# EAGLE schematic I2CRJ45X32 (EAGLE 9.6.2)

## Sheet 1 of 10
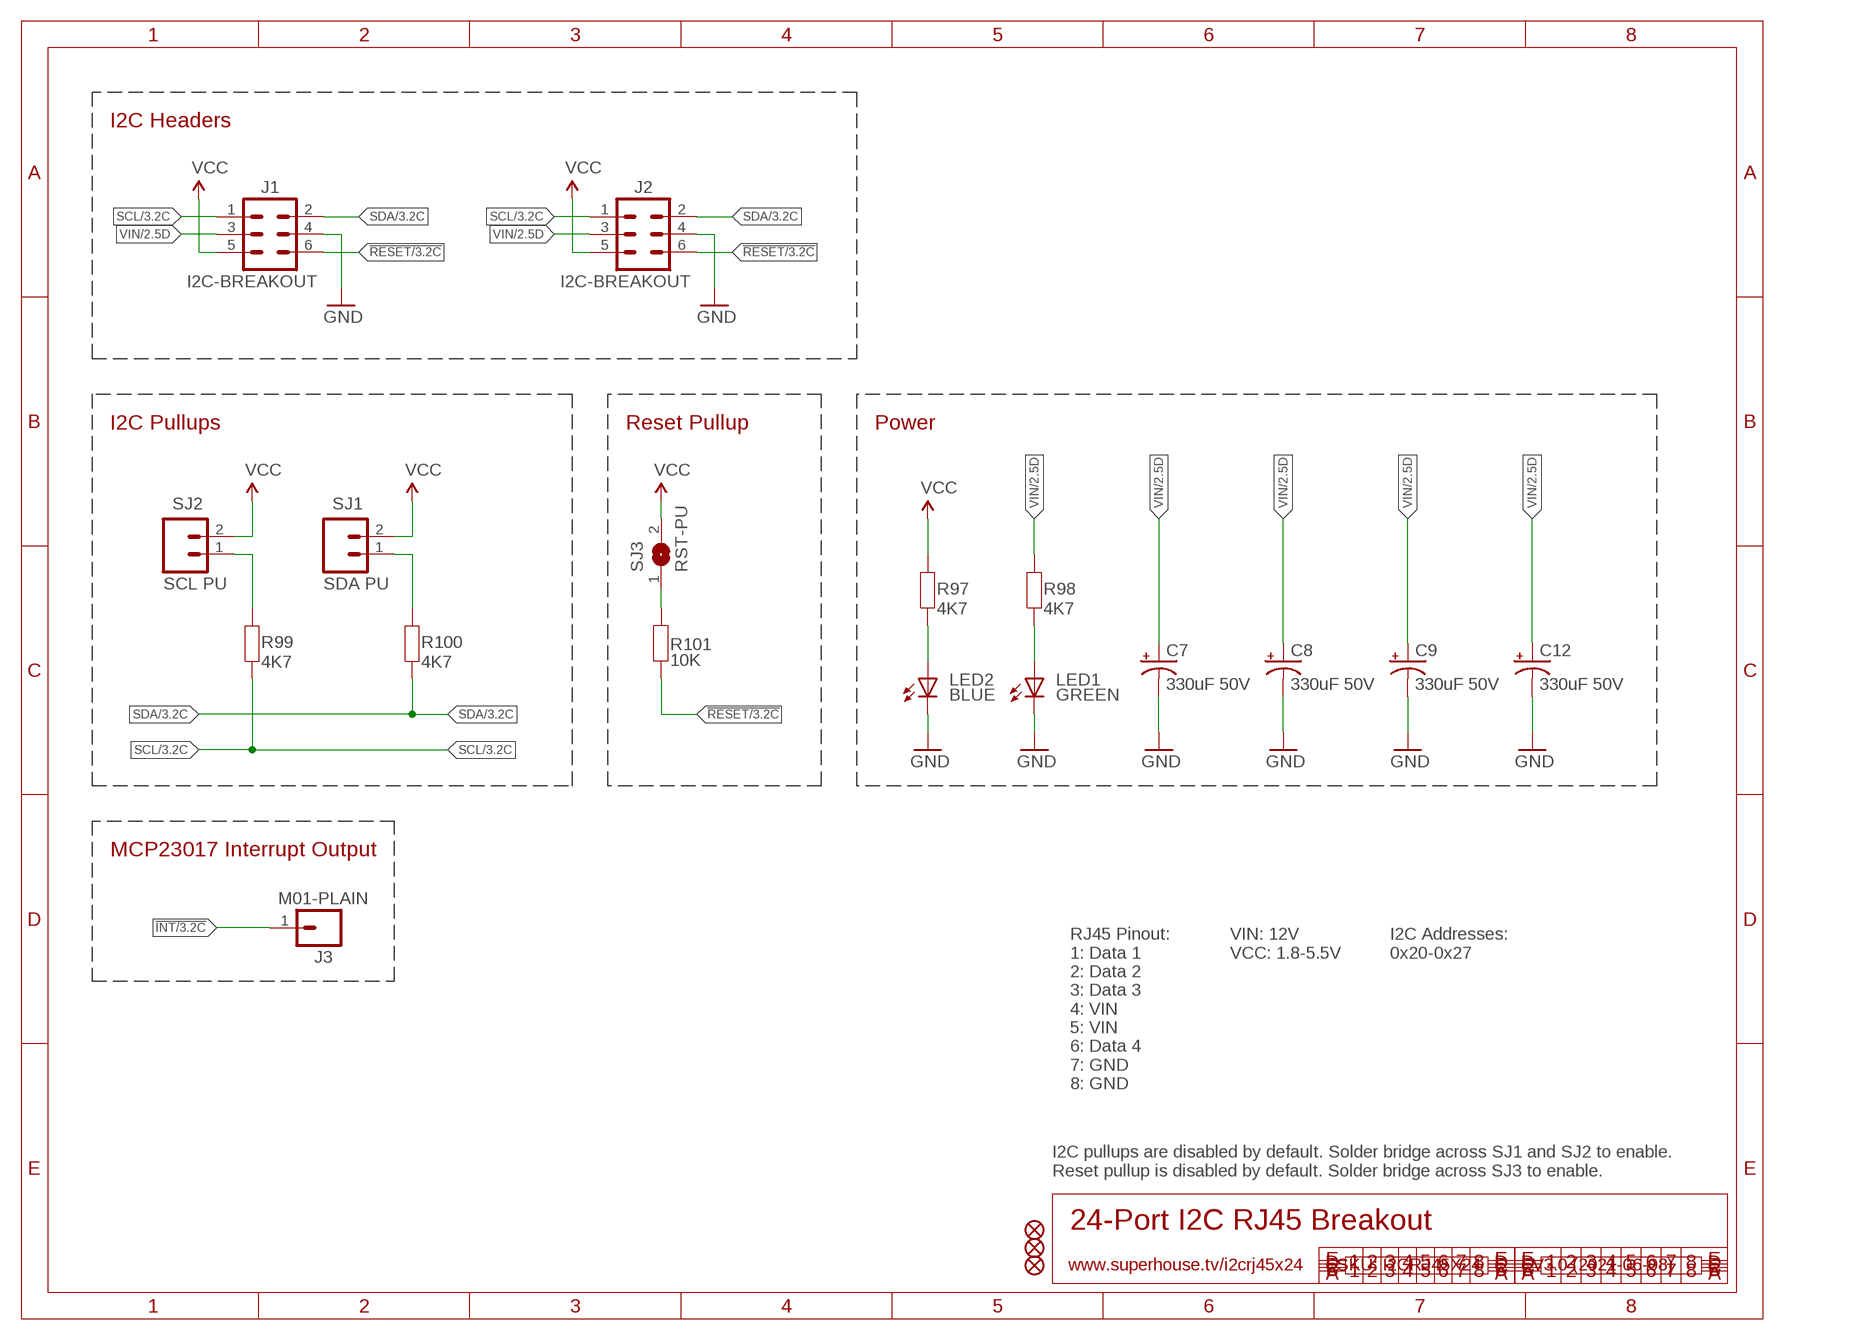
[diagram p0: schematic, sheet 1]

### Parts
C7  330uF 50V  CAP_POLG  [PANASONIC_G]
C8  330uF 50V  CAP_POLG  [PANASONIC_G]
C9  330uF 50V  CAP_POLG  [PANASONIC_G]
C12  330uF 50V  CAP_POLG  [PANASONIC_G]
FID1  FIDUCIAL1X2.5  [FIDUCIAL-1X2.5]
FID2  FIDUCIAL1X2.5  [FIDUCIAL-1X2.5]
FID3  FIDUCIAL1X2.5  [FIDUCIAL-1X2.5]
J1  I2C-BREAKOUT  M02X3-SHROUDED  [2X3-2.54-SHROUDED]
J2  I2C-BREAKOUT  M02X3-SHROUDED  [2X3-2.54-SHROUDED]
J3  M01-PLAIN  [1X01]
LED1  GREEN  LED0603  [LED-0603]
LED2  BLUE  LED0603  [LED-0603]
R97  4K7  RESISTOR0603  [R0603]
R98  4K7  RESISTOR0603  [R0603]
R99  4K7  RESISTOR0603  [R0603]
R100  4K7  RESISTOR0603  [R0603]
R101  10K  RESISTOR0603  [R0603]
SJ1  SDA PU  M02-PIN  [1X02-P]
SJ2  SCL PU  M02-PIN  [1X02-P]
SJ3  RST-PU  SJ-NORMAL  [SJ]

### Nets
!INT: J3.1 ; also sheet 3,4,5,6,7,8,9,10
!RESET: J1.6 J2.6 R101.1 ; also sheet 3,4,5,6,7,8,9,10
GND: C7.- C8.- C9.- C12.- J1.4 J2.4 LED1.C LED2.C ; also sheet 2,3,4,5,6,7,8,9,10
N$1: R99.2 SJ2.1
N$2: R100.2 SJ1.1
N$3: R101.2 SJ3.1
N$7: LED2.A R97.1
N$8: LED1.A R98.1
SCL: J1.1 J2.1 R99.1 ; also sheet 3,4,5,6,7,8,9,10
SDA: J1.2 J2.2 R100.1 ; also sheet 3,4,5,6,7,8,9,10
VCC: J1.5 J2.5 R97.2 SJ1.2 SJ2.2 SJ3.2 ; also sheet 3,4,5,6,7,8,9,10
VIN: C7.+ C8.+ C9.+ C12.+ J1.3 J2.3 R98.2 ; also sheet 2

### Notes on the sheet
- I2C Headers
- I2C Pullups | Reset Pullup | Power
- MCP23017 Interrupt Output
- RJ45 Pinout:
  1: Data 1
  2: Data 2
  3: Data 3
  4: VIN
  5: VIN
  6: Data 4
  7: GND
  8: GND
- VIN: 12V
  VCC: 1.8-5.5V
- I2C Addresses:
  0x20-0x27
- I2C pullups are disabled by default. Solder bridge across SJ1 and SJ2 to enable.
  Reset pullup is disabled by default. Solder bridge across SJ3 to enable.
- 24-Port I2C RJ45 Breakout
- www.superhouse.tv/i2crj45x24 | SKU: I2CRJ45X24 | V3.0 (2021-06-08)

## Sheet 2 of 10
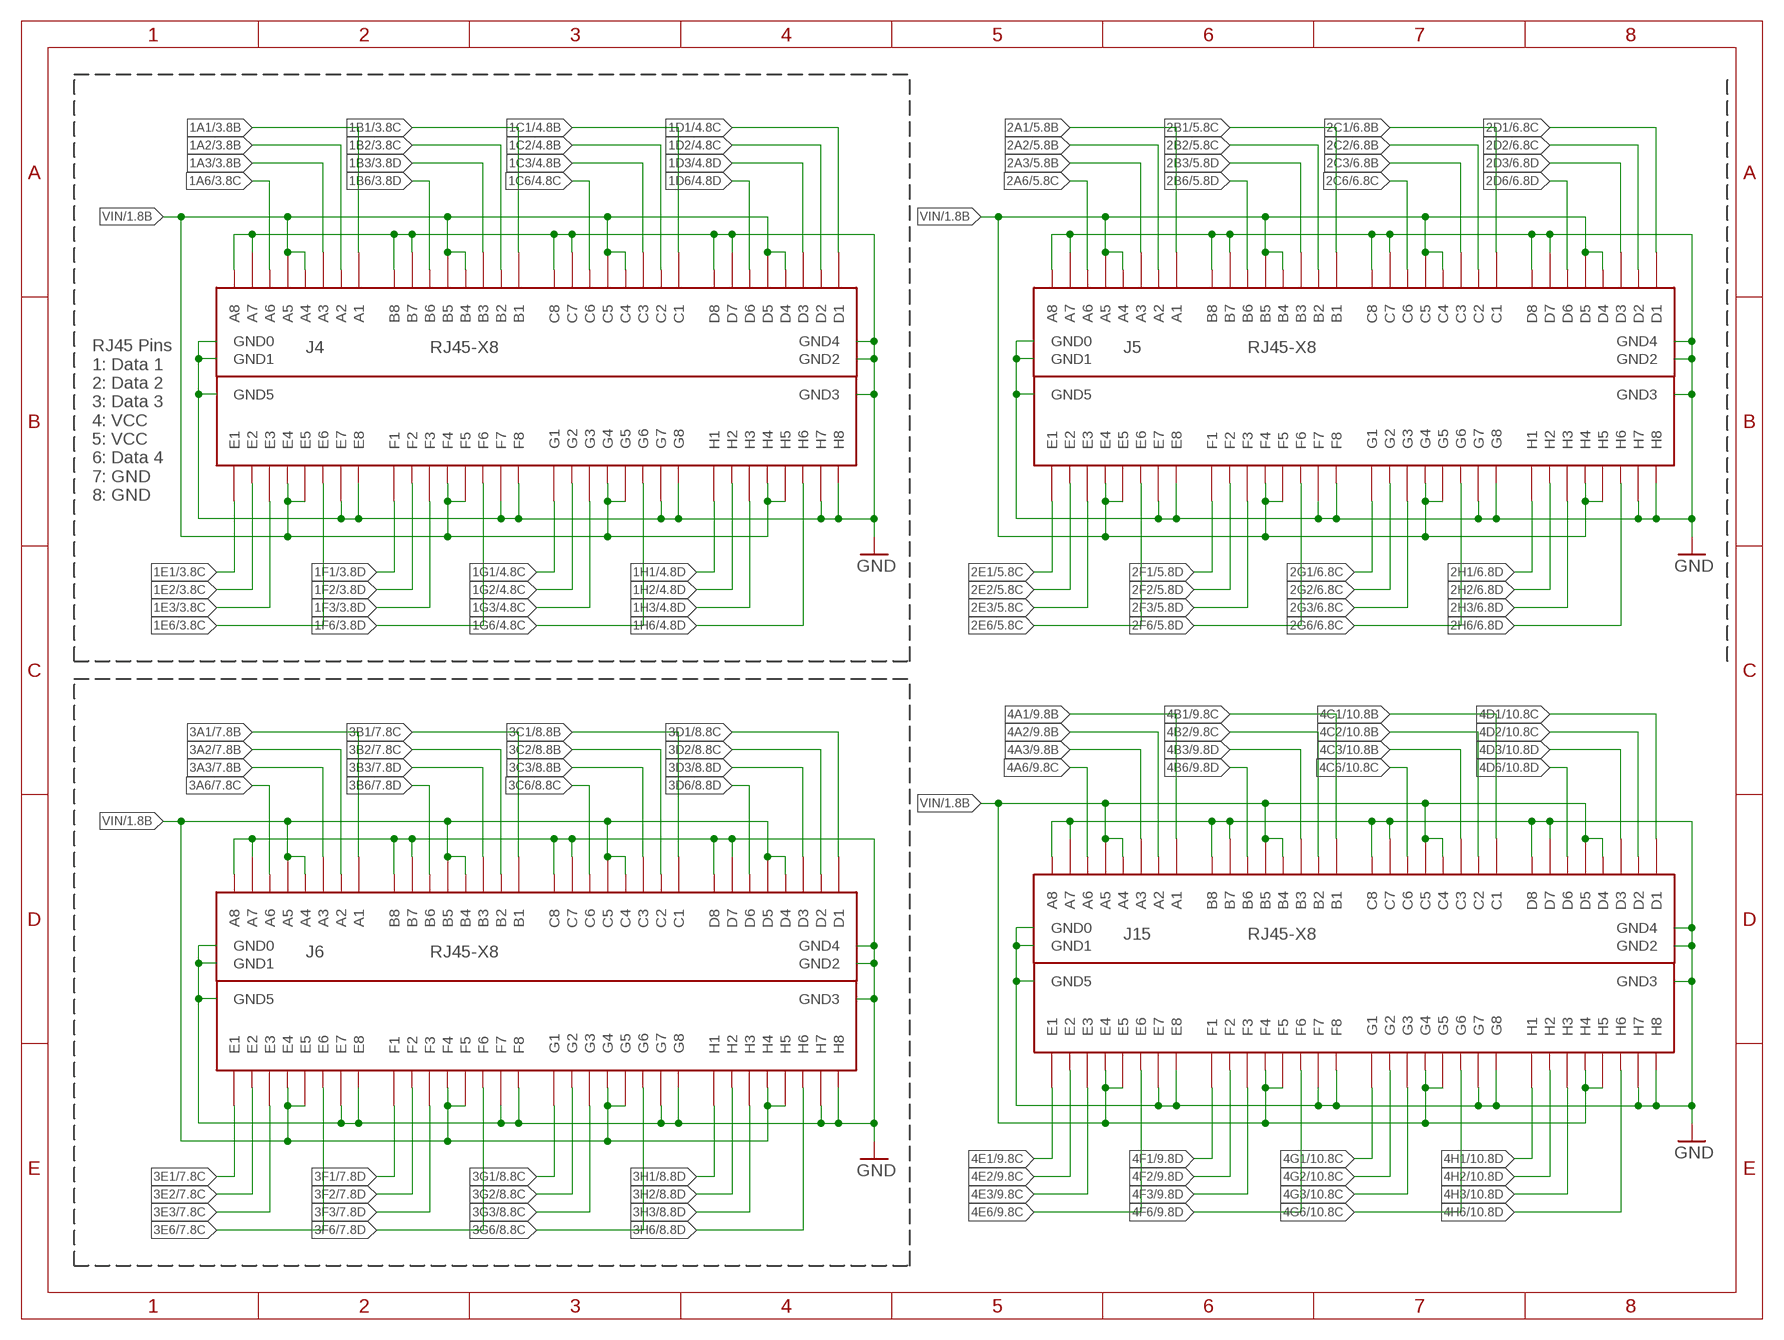
[diagram p1: schematic, sheet 2]

### Parts
J4  RJ45-X8  [RJ45-2X4]
J5  RJ45-X8  [RJ45-2X4]
J6  RJ45-X8  [RJ45-2X4]
J15  RJ45-X8  [RJ45-2X4]

### Nets
1A1: J4.A1 ; also sheet 3
1A2: J4.A2 ; also sheet 3
1A3: J4.A3 ; also sheet 3
1A6: J4.A6 ; also sheet 3
1B1: J4.B1 ; also sheet 3
1B2: J4.B2 ; also sheet 3
1B3: J4.B3 ; also sheet 3
1B6: J4.B6 ; also sheet 3
1C1: J4.C1 ; also sheet 4
1C2: J4.C2 ; also sheet 4
1C3: J4.C3 ; also sheet 4
1C6: J4.C6 ; also sheet 4
1D1: J4.D1 ; also sheet 4
1D2: J4.D2 ; also sheet 4
1D3: J4.D3 ; also sheet 4
1D6: J4.D6 ; also sheet 4
1E1: J4.E1 ; also sheet 3
1E2: J4.E2 ; also sheet 3
1E3: J4.E3 ; also sheet 3
1E6: J4.E6 ; also sheet 3
1F1: J4.F1 ; also sheet 3
1F2: J4.F2 ; also sheet 3
1F3: J4.F3 ; also sheet 3
1F6: J4.F6 ; also sheet 3
1G1: J4.G1 ; also sheet 4
1G2: J4.G2 ; also sheet 4
1G3: J4.G3 ; also sheet 4
1G6: J4.G6 ; also sheet 4
1H1: J4.H1 ; also sheet 4
1H2: J4.H2 ; also sheet 4
1H3: J4.H3 ; also sheet 4
1H6: J4.H6 ; also sheet 4
2A1: J5.A1 ; also sheet 5
2A2: J5.A2 ; also sheet 5
2A3: J5.A3 ; also sheet 5
2A6: J5.A6 ; also sheet 5
2B1: J5.B1 ; also sheet 5
2B2: J5.B2 ; also sheet 5
2B3: J5.B3 ; also sheet 5
2B6: J5.B6 ; also sheet 5
2C1: J5.C1 ; also sheet 6
2C2: J5.C2 ; also sheet 6
2C3: J5.C3 ; also sheet 6
2C6: J5.C6 ; also sheet 6
2D1: J5.D1 ; also sheet 6
2D2: J5.D2 ; also sheet 6
2D3: J5.D3 ; also sheet 6
2D6: J5.D6 ; also sheet 6
2E1: J5.E1 ; also sheet 5
2E2: J5.E2 ; also sheet 5
2E3: J5.E3 ; also sheet 5
2E6: J5.E6 ; also sheet 5
2F1: J5.F1 ; also sheet 5
2F2: J5.F2 ; also sheet 5
2F3: J5.F3 ; also sheet 5
2F6: J5.F6 ; also sheet 5
2G1: J5.G1 ; also sheet 6
2G2: J5.G2 ; also sheet 6
2G3: J5.G3 ; also sheet 6
2G6: J5.G6 ; also sheet 6
2H1: J5.H1 ; also sheet 6
2H2: J5.H2 ; also sheet 6
2H3: J5.H3 ; also sheet 6
2H6: J5.H6 ; also sheet 6
3A1: J6.A1 ; also sheet 7
3A2: J6.A2 ; also sheet 7
3A3: J6.A3 ; also sheet 7
3A6: J6.A6 ; also sheet 7
3B1: J6.B1 ; also sheet 7
3B2: J6.B2 ; also sheet 7
3B3: J6.B3 ; also sheet 7
3B6: J6.B6 ; also sheet 7
3C1: J6.C1 ; also sheet 8
3C2: J6.C2 ; also sheet 8
3C3: J6.C3 ; also sheet 8
3C6: J6.C6 ; also sheet 8
3D1: J6.D1 ; also sheet 8
3D2: J6.D2 ; also sheet 8
3D3: J6.D3 ; also sheet 8
3D6: J6.D6 ; also sheet 8
3E1: J6.E1 ; also sheet 7
3E2: J6.E2 ; also sheet 7
3E3: J6.E3 ; also sheet 7
3E6: J6.E6 ; also sheet 7
3F1: J6.F1 ; also sheet 7
3F2: J6.F2 ; also sheet 7
3F3: J6.F3 ; also sheet 7
3F6: J6.F6 ; also sheet 7
3G1: J6.G1 ; also sheet 8
3G2: J6.G2 ; also sheet 8
3G3: J6.G3 ; also sheet 8
3G6: J6.G6 ; also sheet 8
3H1: J6.H1 ; also sheet 8
3H2: J6.H2 ; also sheet 8
3H3: J6.H3 ; also sheet 8
3H6: J6.H6 ; also sheet 8
4A1: J15.A1 ; also sheet 9
4A2: J15.A2 ; also sheet 9
4A3: J15.A3 ; also sheet 9
4A6: J15.A6 ; also sheet 9
4B1: J15.B1 ; also sheet 9
4B2: J15.B2 ; also sheet 9
4B3: J15.B3 ; also sheet 9
4B6: J15.B6 ; also sheet 9
4C1: J15.C1 ; also sheet 10
4C2: J15.C2 ; also sheet 10
4C3: J15.C3 ; also sheet 10
4C6: J15.C6 ; also sheet 10
4D1: J15.D1 ; also sheet 10
4D2: J15.D2 ; also sheet 10
4D3: J15.D3 ; also sheet 10
4D6: J15.D6 ; also sheet 10
4E1: J15.E1 ; also sheet 9
4E2: J15.E2 ; also sheet 9
4E3: J15.E3 ; also sheet 9
4E6: J15.E6 ; also sheet 9
4F1: J15.F1 ; also sheet 9
4F2: J15.F2 ; also sheet 9
4F3: J15.F3 ; also sheet 9
4F6: J15.F6 ; also sheet 9
4G1: J15.G1 ; also sheet 10
4G2: J15.G2 ; also sheet 10
4G3: J15.G3 ; also sheet 10
4G6: J15.G6 ; also sheet 10
4H1: J15.H1 ; also sheet 10
4H2: J15.H2 ; also sheet 10
4H3: J15.H3 ; also sheet 10
4H6: J15.H6 ; also sheet 10
GND: J4.A7 J4.A8 J4.B7 J4.B8 J4.C7 J4.C8 J4.D7 J4.D8 J4.E7 J4.E8 J4.F7 J4.F8 J4.G7 J4.G8 J4.GND0 J4.GND1 J4.GND2 J4.GND3 J4.GND4 J4.GND5 J4.H7 J4.H8 J5.A7 J5.A8 J5.B7 J5.B8 J5.C7 J5.C8 J5.D7 J5.D8 J5.E7 J5.E8 J5.F7 J5.F8 J5.G7 J5.G8 J5.GND0 J5.GND1 J5.GND2 J5.GND3 J5.GND4 J5.GND5 J5.H7 J5.H8 J6.A7 J6.A8 J6.B7 J6.B8 J6.C7 J6.C8 J6.D7 J6.D8 J6.E7 J6.E8 J6.F7 J6.F8 J6.G7 J6.G8 J6.GND0 J6.GND1 J6.GND2 J6.GND3 J6.GND4 J6.GND5 J6.H7 J6.H8 J15.A7 J15.A8 J15.B7 J15.B8 J15.C7 J15.C8 J15.D7 J15.D8 J15.E7 J15.E8 J15.F7 J15.F8 J15.G7 J15.G8 J15.GND0 J15.GND1 J15.GND2 J15.GND3 J15.GND4 J15.GND5 J15.H7 J15.H8 ; also sheet 1,3,4,5,6,7,8,9,10
VIN: J4.A4 J4.A5 J4.B4 J4.B5 J4.C4 J4.C5 J4.D4 J4.D5 J4.E4 J4.E5 J4.F4 J4.F5 J4.G4 J4.G5 J4.H4 J4.H5 J5.A4 J5.A5 J5.B4 J5.B5 J5.C4 J5.C5 J5.D4 J5.D5 J5.E4 J5.E5 J5.F4 J5.F5 J5.G4 J5.G5 J5.H4 J5.H5 J6.A4 J6.A5 J6.B4 J6.B5 J6.C4 J6.C5 J6.D4 J6.D5 J6.E4 J6.E5 J6.F4 J6.F5 J6.G4 J6.G5 J6.H4 J6.H5 J15.A4 J15.A5 J15.B4 J15.B5 J15.C4 J15.C5 J15.D4 J15.D5 J15.E4 J15.E5 J15.F4 J15.F5 J15.G4 J15.G5 J15.H4 J15.H5 ; also sheet 1

### Notes on the sheet
- RJ45 Pins
  1: Data 1
  2: Data 2
  3: Data 3
  4: VCC
  5: VCC
  6: Data 4
  7: GND
  8: GND

## Sheet 3 of 10
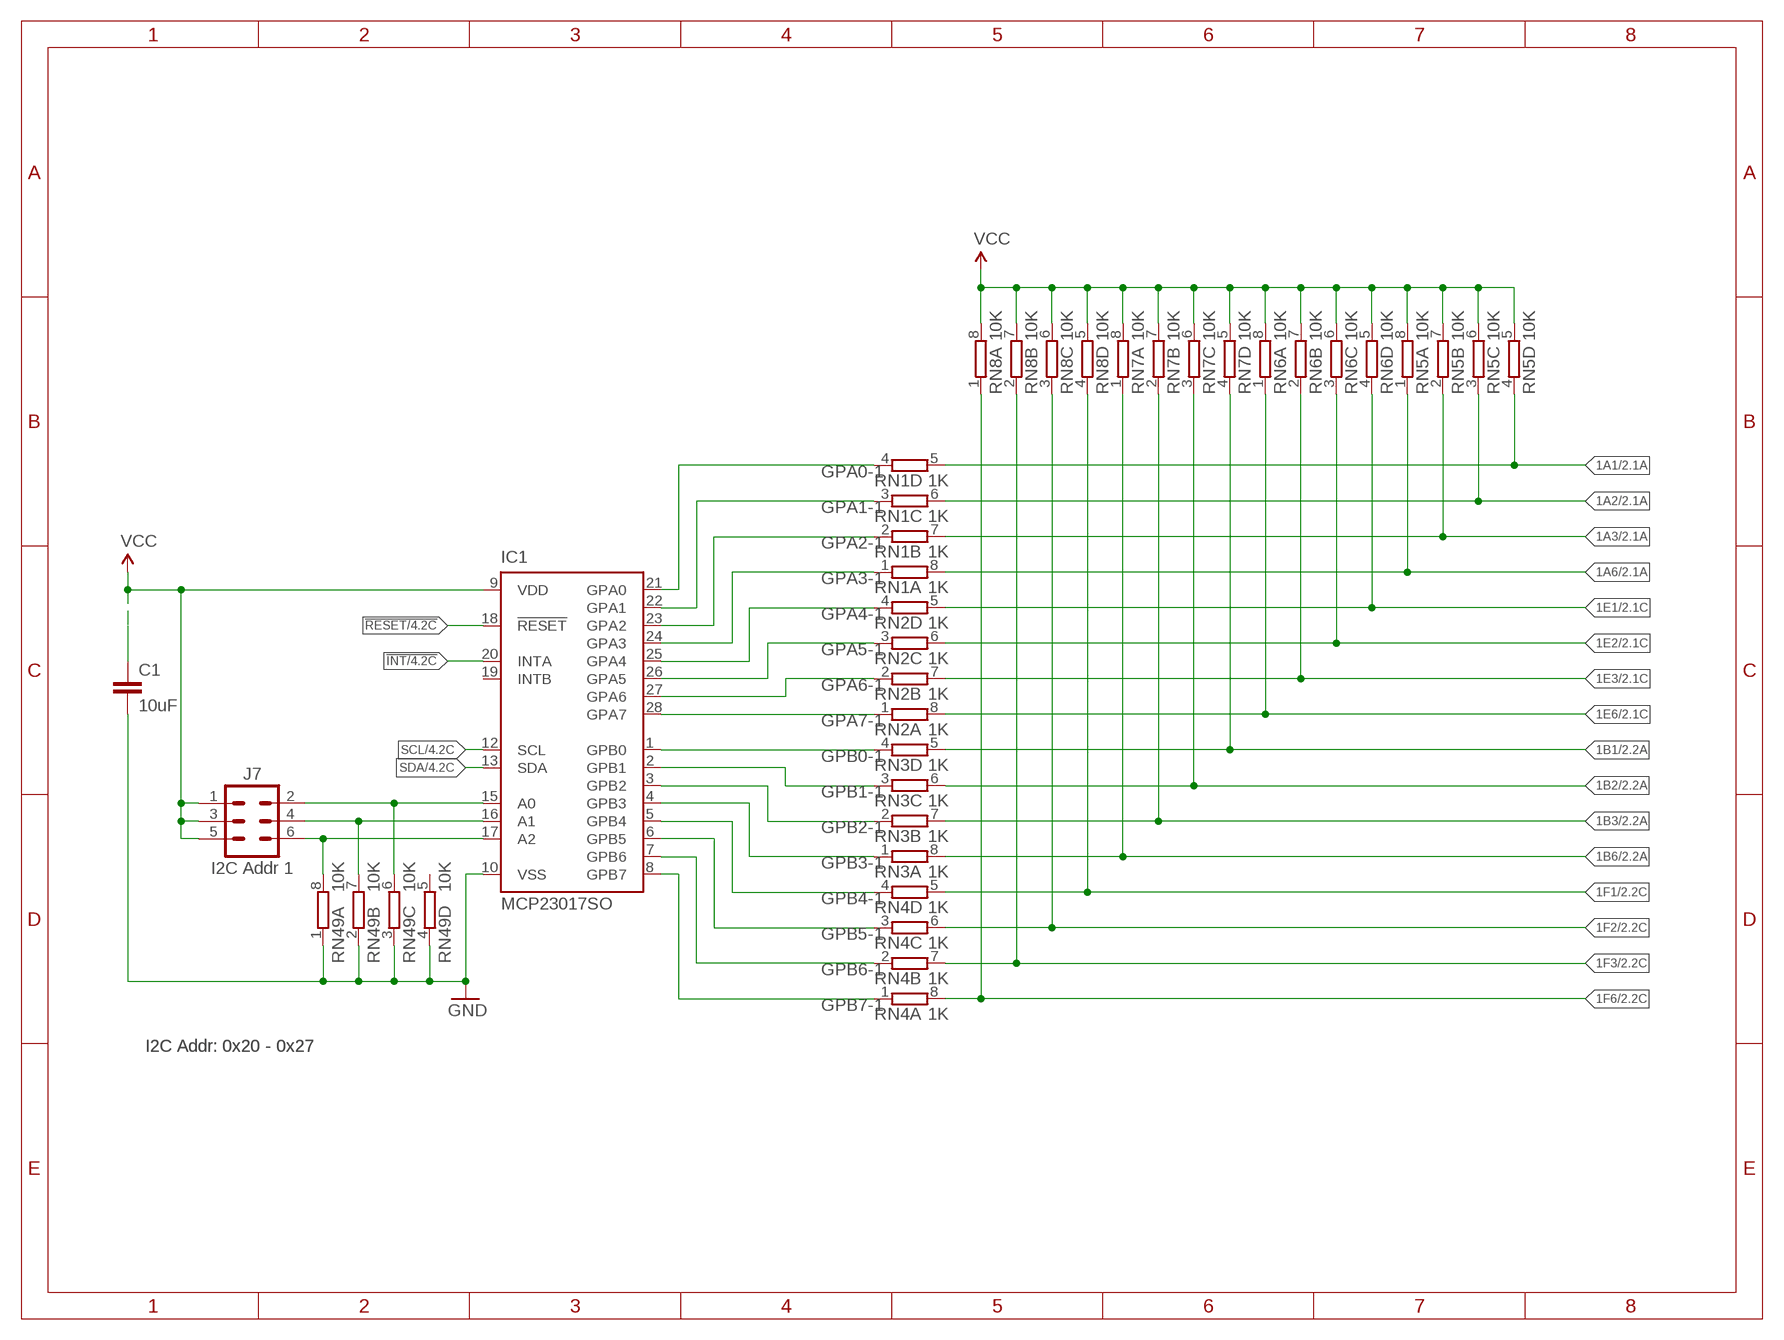
[diagram p2: schematic, sheet 3]

### Parts
C1  10uF  CAP0805  [C0805]
IC1  MCP23017SO  [SO28W]
J7  I2C Addr 1  M02X3-PIN  [2X03-P]
RN1  1K  4R-NCAY16  [CAY16]
RN2  1K  4R-NCAY16  [CAY16]
RN3  1K  4R-NCAY16  [CAY16]
RN4  1K  4R-NCAY16  [CAY16]
RN5  10K  4R-NCAY16  [CAY16]
RN6  10K  4R-NCAY16  [CAY16]
RN7  10K  4R-NCAY16  [CAY16]
RN8  10K  4R-NCAY16  [CAY16]
RN49  10K  4R-NCAY16  [CAY16]

### Nets
1A1: RN1.5 RN5.4 ; also sheet 2
1A2: RN1.6 RN5.3 ; also sheet 2
1A3: RN1.7 RN5.2 ; also sheet 2
1A6: RN1.8 RN5.1 ; also sheet 2
1B1: RN3.5 RN7.4 ; also sheet 2
1B2: RN3.6 RN7.3 ; also sheet 2
1B3: RN3.7 RN7.2 ; also sheet 2
1B6: RN3.8 RN7.1 ; also sheet 2
1E1: RN2.5 RN6.4 ; also sheet 2
1E2: RN2.6 RN6.3 ; also sheet 2
1E3: RN2.7 RN6.2 ; also sheet 2
1E6: RN2.8 RN6.1 ; also sheet 2
1F1: RN4.5 RN8.4 ; also sheet 2
1F2: RN4.6 RN8.3 ; also sheet 2
1F3: RN4.7 RN8.2 ; also sheet 2
1F6: RN4.8 RN8.1 ; also sheet 2
!INT: IC1.20(INTA) ; also sheet 1,4,5,6,7,8,9,10
!RESET: IC1.18(!RESET) ; also sheet 1,4,5,6,7,8,9,10
GND: C1.2 IC1.10(VSS) RN49.1 RN49.2 RN49.3 RN49.4 ; also sheet 1,2,4,5,6,7,8,9,10
GPA0-1: IC1.21(GPA0) RN1.4
GPA1-1: IC1.22(GPA1) RN1.3
GPA2-1: IC1.23(GPA2) RN1.2
GPA3-1: IC1.24(GPA3) RN1.1
GPA4-1: IC1.25(GPA4) RN2.4
GPA5-1: IC1.26(GPA5) RN2.3
GPA6-1: IC1.27(GPA6) RN2.2
GPA7-1: IC1.28(GPA7) RN2.1
GPB0-1: IC1.1(GPB0) RN3.4
GPB1-1: IC1.2(GPB1) RN3.3
GPB2-1: IC1.3(GPB2) RN3.2
GPB3-1: IC1.4(GPB3) RN3.1
GPB4-1: IC1.5(GPB4) RN4.4
GPB5-1: IC1.6(GPB5) RN4.3
GPB6-1: IC1.7(GPB6) RN4.2
GPB7-1: IC1.8(GPB7) RN4.1
N$4: IC1.17(A2) J7.6 RN49.8
N$5: IC1.16(A1) J7.4 RN49.7
N$6: IC1.15(A0) J7.2 RN49.6
SCL: IC1.12(SCL) ; also sheet 1,4,5,6,7,8,9,10
SDA: IC1.13(SDA) ; also sheet 1,4,5,6,7,8,9,10
VCC: C1.1 IC1.9(VDD) J7.1 J7.3 J7.5 RN5.5 RN5.6 RN5.7 RN5.8 RN6.5 RN6.6 RN6.7 RN6.8 RN7.5 RN7.6 RN7.7 RN7.8 RN8.5 RN8.6 RN8.7 RN8.8 ; also sheet 1,4,5,6,7,8,9,10
Unconnected: IC1.19(INTB) RN49.5

### Notes on the sheet
- I2C Addr: 0x20 - 0x27 | I2C Addr: 0x20 - 0x27

## Sheet 4 of 10
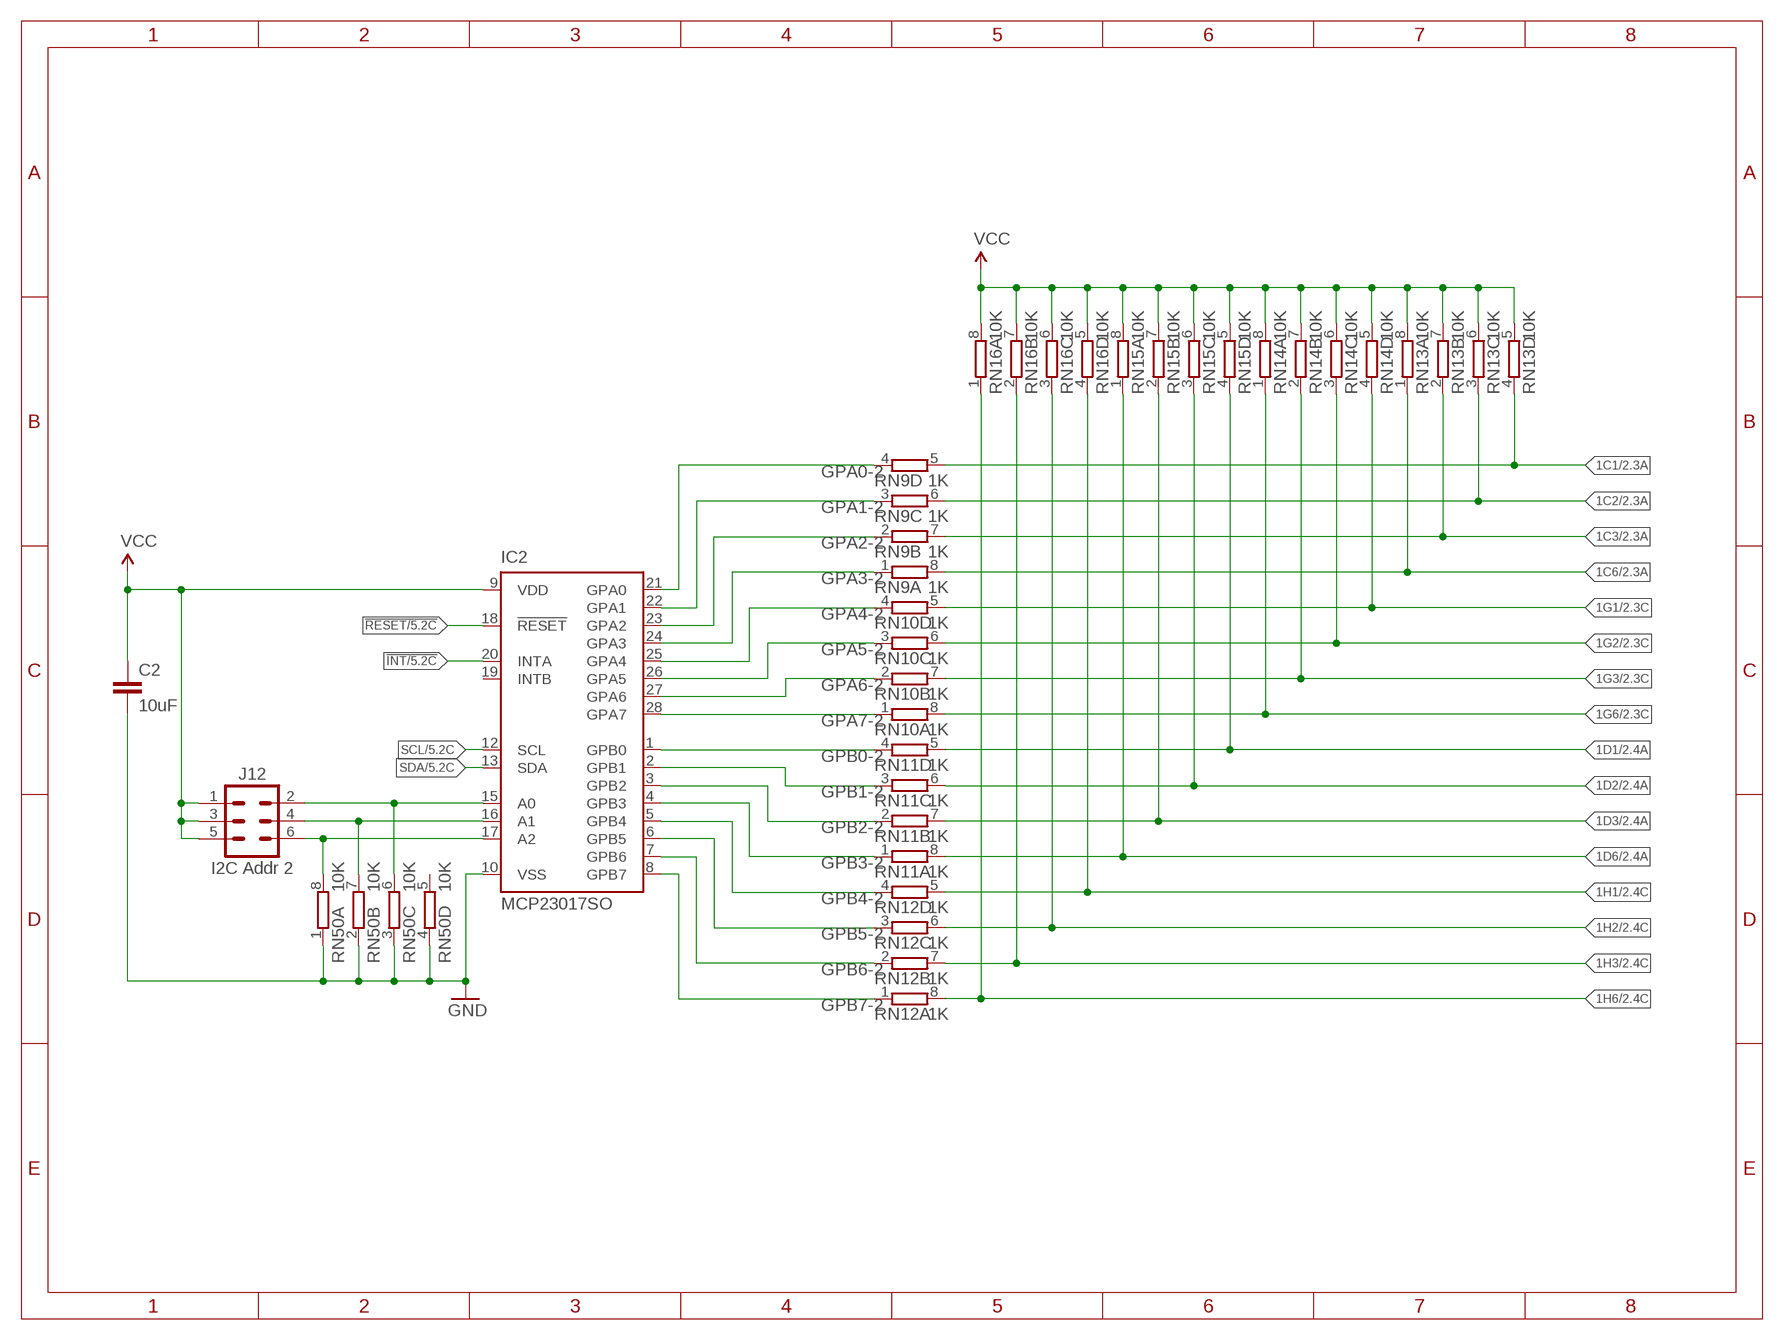
[diagram p3: schematic, sheet 4]

### Parts
C2  10uF  CAP0805  [C0805]
IC2  MCP23017SO  [SO28W]
J12  I2C Addr 2  M02X3-PIN  [2X03-P]
RN9  1K  4R-NCAY16  [CAY16]
RN10  1K  4R-NCAY16  [CAY16]
RN11  1K  4R-NCAY16  [CAY16]
RN12  1K  4R-NCAY16  [CAY16]
RN13  10K  4R-NCAY16  [CAY16]
RN14  10K  4R-NCAY16  [CAY16]
RN15  10K  4R-NCAY16  [CAY16]
RN16  10K  4R-NCAY16  [CAY16]
RN50  10K  4R-NCAY16  [CAY16]

### Nets
1C1: RN9.5 RN13.4 ; also sheet 2
1C2: RN9.6 RN13.3 ; also sheet 2
1C3: RN9.7 RN13.2 ; also sheet 2
1C6: RN9.8 RN13.1 ; also sheet 2
1D1: RN11.5 RN15.4 ; also sheet 2
1D2: RN11.6 RN15.3 ; also sheet 2
1D3: RN11.7 RN15.2 ; also sheet 2
1D6: RN11.8 RN15.1 ; also sheet 2
1G1: RN10.5 RN14.4 ; also sheet 2
1G2: RN10.6 RN14.3 ; also sheet 2
1G3: RN10.7 RN14.2 ; also sheet 2
1G6: RN10.8 RN14.1 ; also sheet 2
1H1: RN12.5 RN16.4 ; also sheet 2
1H2: RN12.6 RN16.3 ; also sheet 2
1H3: RN12.7 RN16.2 ; also sheet 2
1H6: RN12.8 RN16.1 ; also sheet 2
!INT: IC2.20(INTA) ; also sheet 1,3,5,6,7,8,9,10
!RESET: IC2.18(!RESET) ; also sheet 1,3,5,6,7,8,9,10
GND: C2.2 IC2.10(VSS) RN50.1 RN50.2 RN50.3 RN50.4 ; also sheet 1,2,3,5,6,7,8,9,10
GPA0-2: IC2.21(GPA0) RN9.4
GPA1-2: IC2.22(GPA1) RN9.3
GPA2-2: IC2.23(GPA2) RN9.2
GPA3-2: IC2.24(GPA3) RN9.1
GPA4-2: IC2.25(GPA4) RN10.4
GPA5-2: IC2.26(GPA5) RN10.3
GPA6-2: IC2.27(GPA6) RN10.2
GPA7-2: IC2.28(GPA7) RN10.1
GPB0-2: IC2.1(GPB0) RN11.4
GPB1-2: IC2.2(GPB1) RN11.3
GPB2-2: IC2.3(GPB2) RN11.2
GPB3-2: IC2.4(GPB3) RN11.1
GPB4-2: IC2.5(GPB4) RN12.4
GPB5-2: IC2.6(GPB5) RN12.3
GPB6-2: IC2.7(GPB6) RN12.2
GPB7-2: IC2.8(GPB7) RN12.1
N$9: IC2.15(A0) J12.2 RN50.6
N$10: IC2.16(A1) J12.4 RN50.7
N$11: IC2.17(A2) J12.6 RN50.8
SCL: IC2.12(SCL) ; also sheet 1,3,5,6,7,8,9,10
SDA: IC2.13(SDA) ; also sheet 1,3,5,6,7,8,9,10
VCC: C2.1 IC2.9(VDD) J12.1 J12.3 J12.5 RN13.5 RN13.6 RN13.7 RN13.8 RN14.5 RN14.6 RN14.7 RN14.8 RN15.5 RN15.6 RN15.7 RN15.8 RN16.5 RN16.6 RN16.7 RN16.8 ; also sheet 1,3,5,6,7,8,9,10
Unconnected: IC2.19(INTB) RN50.5

## Sheet 5 of 10
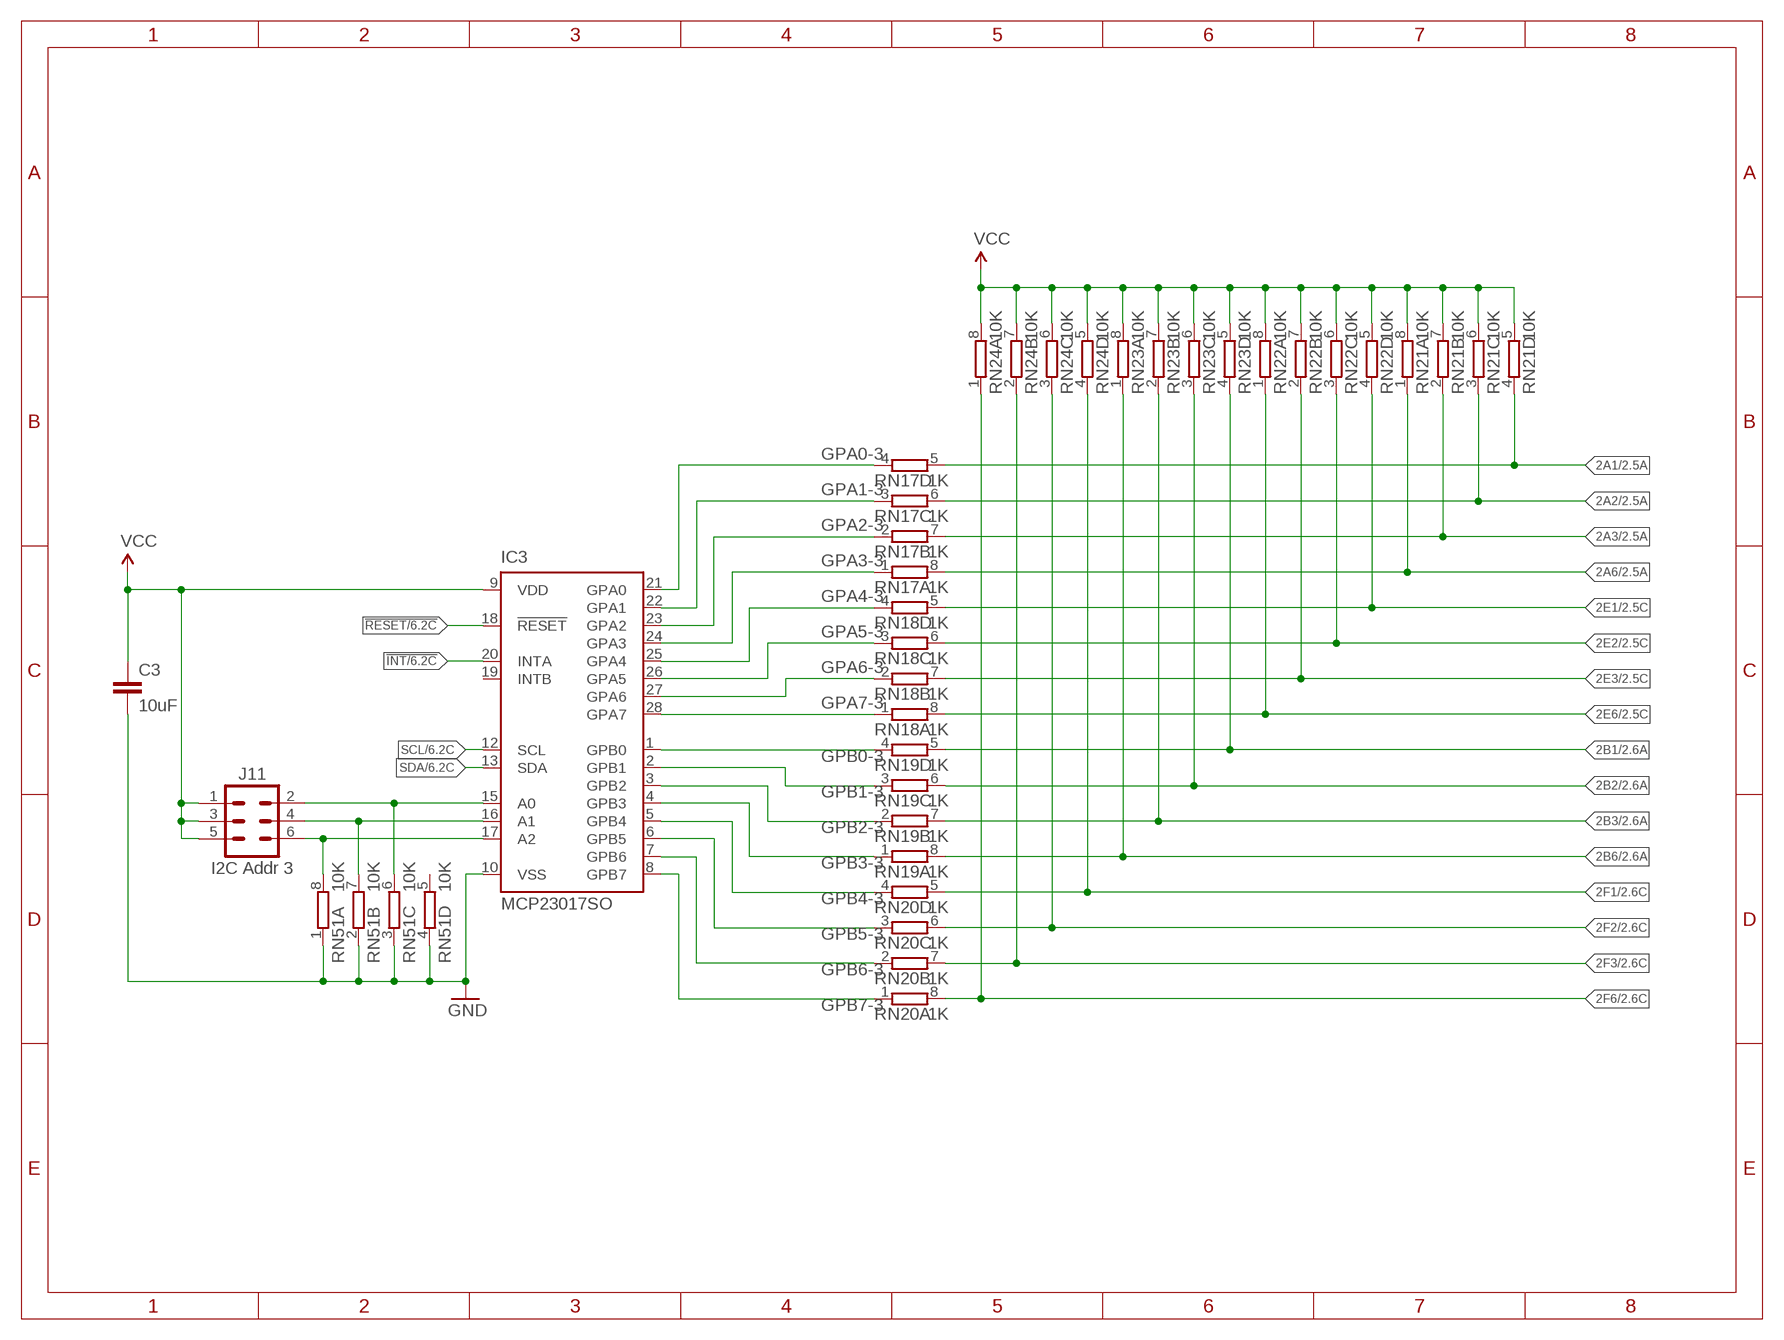
[diagram p4: schematic, sheet 5]

### Parts
C3  10uF  CAP0805  [C0805]
IC3  MCP23017SO  [SO28W]
J11  I2C Addr 3  M02X3-PIN  [2X03-P]
RN17  1K  4R-NCAY16  [CAY16]
RN18  1K  4R-NCAY16  [CAY16]
RN19  1K  4R-NCAY16  [CAY16]
RN20  1K  4R-NCAY16  [CAY16]
RN21  10K  4R-NCAY16  [CAY16]
RN22  10K  4R-NCAY16  [CAY16]
RN23  10K  4R-NCAY16  [CAY16]
RN24  10K  4R-NCAY16  [CAY16]
RN51  10K  4R-NCAY16  [CAY16]

### Nets
2A1: RN17.5 RN21.4 ; also sheet 2
2A2: RN17.6 RN21.3 ; also sheet 2
2A3: RN17.7 RN21.2 ; also sheet 2
2A6: RN17.8 RN21.1 ; also sheet 2
2B1: RN19.5 RN23.4 ; also sheet 2
2B2: RN19.6 RN23.3 ; also sheet 2
2B3: RN19.7 RN23.2 ; also sheet 2
2B6: RN19.8 RN23.1 ; also sheet 2
2E1: RN18.5 RN22.4 ; also sheet 2
2E2: RN18.6 RN22.3 ; also sheet 2
2E3: RN18.7 RN22.2 ; also sheet 2
2E6: RN18.8 RN22.1 ; also sheet 2
2F1: RN20.5 RN24.4 ; also sheet 2
2F2: RN20.6 RN24.3 ; also sheet 2
2F3: RN20.7 RN24.2 ; also sheet 2
2F6: RN20.8 RN24.1 ; also sheet 2
!INT: IC3.20(INTA) ; also sheet 1,3,4,6,7,8,9,10
!RESET: IC3.18(!RESET) ; also sheet 1,3,4,6,7,8,9,10
GND: C3.2 IC3.10(VSS) RN51.1 RN51.2 RN51.3 RN51.4 ; also sheet 1,2,3,4,6,7,8,9,10
GPA0-3: IC3.21(GPA0) RN17.4
GPA1-3: IC3.22(GPA1) RN17.3
GPA2-3: IC3.23(GPA2) RN17.2
GPA3-3: IC3.24(GPA3) RN17.1
GPA4-3: IC3.25(GPA4) RN18.4
GPA5-3: IC3.26(GPA5) RN18.3
GPA6-3: IC3.27(GPA6) RN18.2
GPA7-3: IC3.28(GPA7) RN18.1
GPB0-3: IC3.1(GPB0) RN19.4
GPB1-3: IC3.2(GPB1) RN19.3
GPB2-3: IC3.3(GPB2) RN19.2
GPB3-3: IC3.4(GPB3) RN19.1
GPB4-3: IC3.5(GPB4) RN20.4
GPB5-3: IC3.6(GPB5) RN20.3
GPB6-3: IC3.7(GPB6) RN20.2
GPB7-3: IC3.8(GPB7) RN20.1
N$12: IC3.17(A2) J11.6 RN51.8
N$13: IC3.15(A0) J11.2 RN51.6
N$14: IC3.16(A1) J11.4 RN51.7
SCL: IC3.12(SCL) ; also sheet 1,3,4,6,7,8,9,10
SDA: IC3.13(SDA) ; also sheet 1,3,4,6,7,8,9,10
VCC: C3.1 IC3.9(VDD) J11.1 J11.3 J11.5 RN21.5 RN21.6 RN21.7 RN21.8 RN22.5 RN22.6 RN22.7 RN22.8 RN23.5 RN23.6 RN23.7 RN23.8 RN24.5 RN24.6 RN24.7 RN24.8 ; also sheet 1,3,4,6,7,8,9,10
Unconnected: IC3.19(INTB) RN51.5

## Sheet 6 of 10
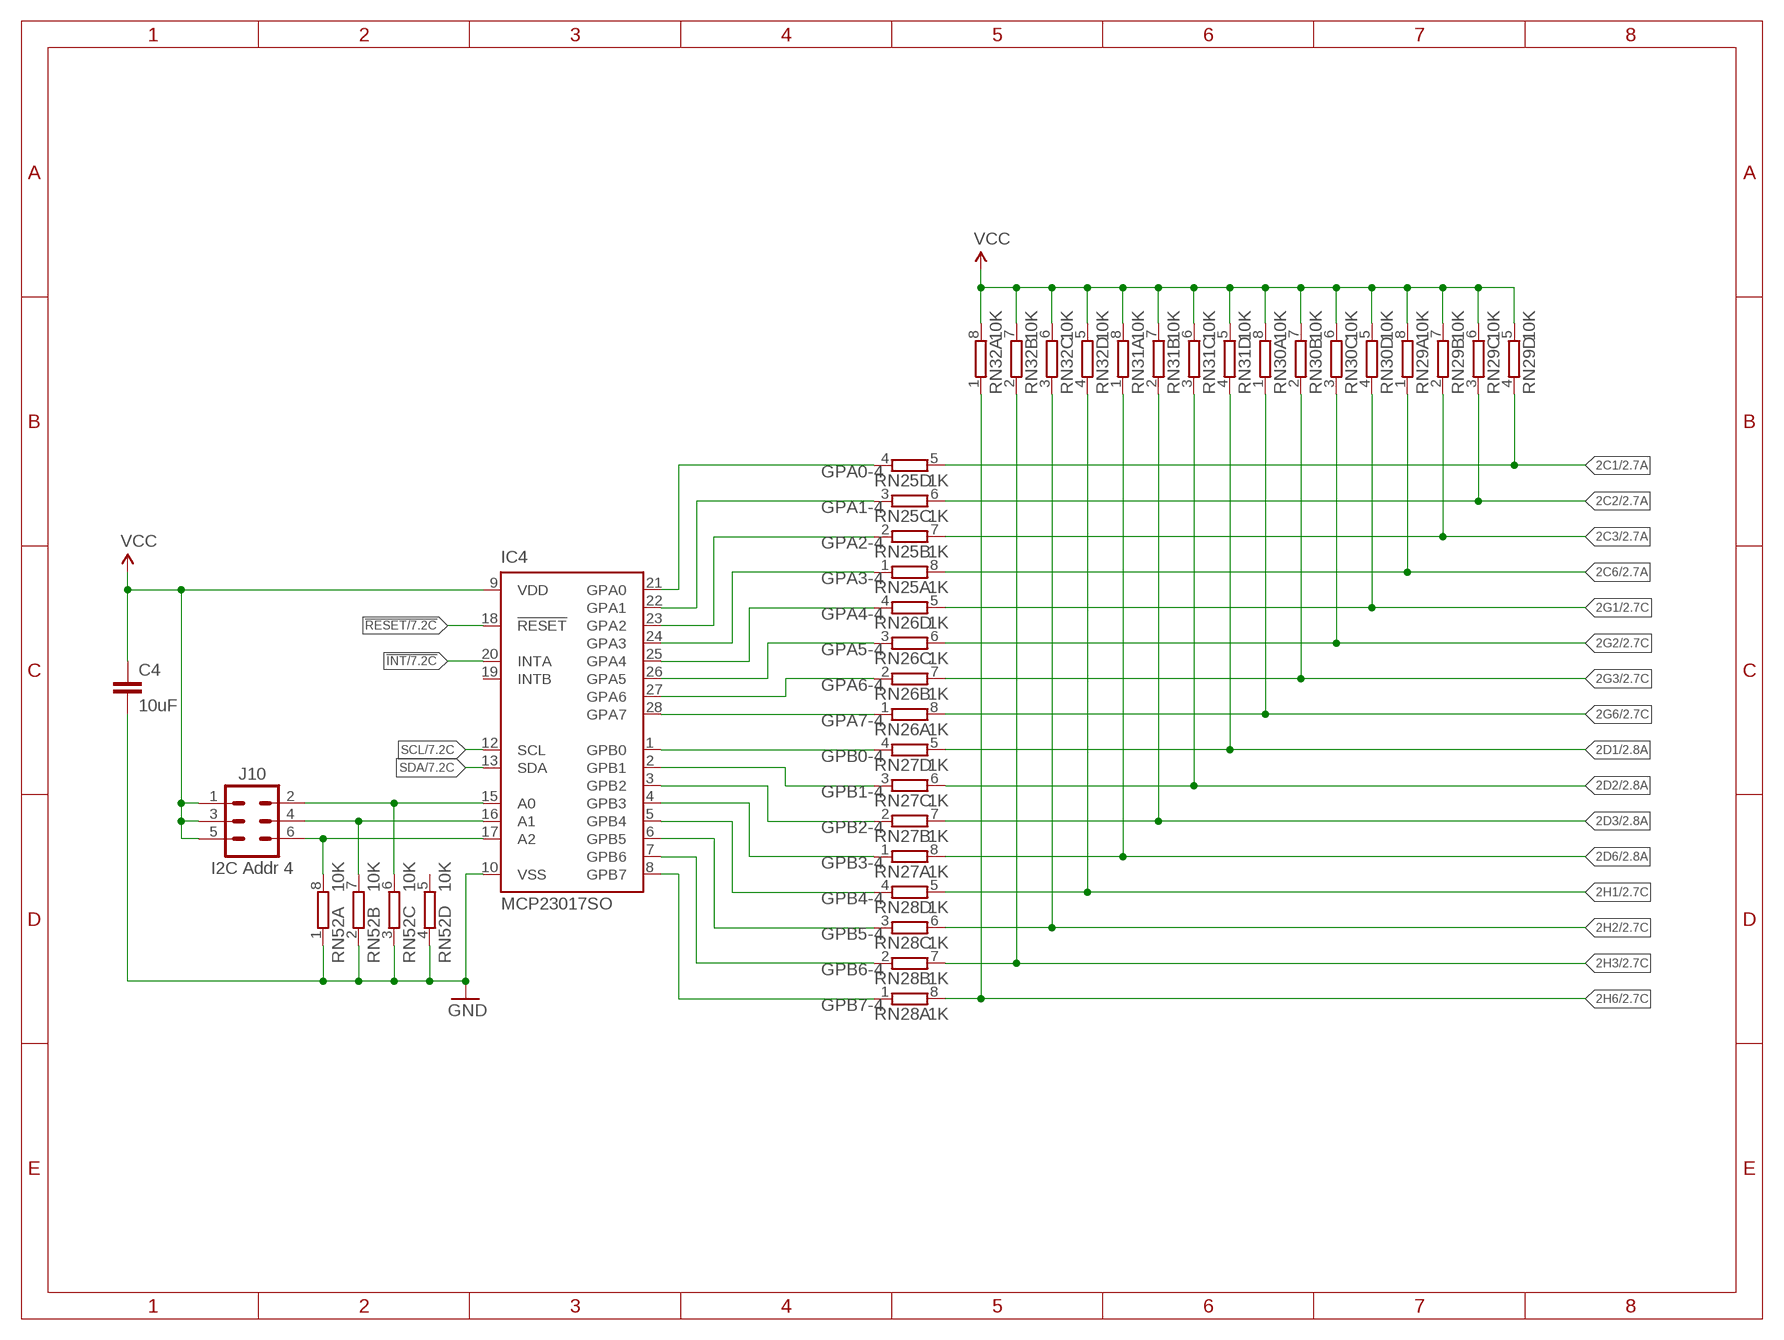
[diagram p5: schematic, sheet 6]

### Parts
C4  10uF  CAP0805  [C0805]
IC4  MCP23017SO  [SO28W]
J10  I2C Addr 4  M02X3-PIN  [2X03-P]
RN25  1K  4R-NCAY16  [CAY16]
RN26  1K  4R-NCAY16  [CAY16]
RN27  1K  4R-NCAY16  [CAY16]
RN28  1K  4R-NCAY16  [CAY16]
RN29  10K  4R-NCAY16  [CAY16]
RN30  10K  4R-NCAY16  [CAY16]
RN31  10K  4R-NCAY16  [CAY16]
RN32  10K  4R-NCAY16  [CAY16]
RN52  10K  4R-NCAY16  [CAY16]

### Nets
2C1: RN25.5 RN29.4 ; also sheet 2
2C2: RN25.6 RN29.3 ; also sheet 2
2C3: RN25.7 RN29.2 ; also sheet 2
2C6: RN25.8 RN29.1 ; also sheet 2
2D1: RN27.5 RN31.4 ; also sheet 2
2D2: RN27.6 RN31.3 ; also sheet 2
2D3: RN27.7 RN31.2 ; also sheet 2
2D6: RN27.8 RN31.1 ; also sheet 2
2G1: RN26.5 RN30.4 ; also sheet 2
2G2: RN26.6 RN30.3 ; also sheet 2
2G3: RN26.7 RN30.2 ; also sheet 2
2G6: RN26.8 RN30.1 ; also sheet 2
2H1: RN28.5 RN32.4 ; also sheet 2
2H2: RN28.6 RN32.3 ; also sheet 2
2H3: RN28.7 RN32.2 ; also sheet 2
2H6: RN28.8 RN32.1 ; also sheet 2
!INT: IC4.20(INTA) ; also sheet 1,3,4,5,7,8,9,10
!RESET: IC4.18(!RESET) ; also sheet 1,3,4,5,7,8,9,10
GND: C4.2 IC4.10(VSS) RN52.1 RN52.2 RN52.3 RN52.4 ; also sheet 1,2,3,4,5,7,8,9,10
GPA0-4: IC4.21(GPA0) RN25.4
GPA1-4: IC4.22(GPA1) RN25.3
GPA2-4: IC4.23(GPA2) RN25.2
GPA3-4: IC4.24(GPA3) RN25.1
GPA4-4: IC4.25(GPA4) RN26.4
GPA5-4: IC4.26(GPA5) RN26.3
GPA6-4: IC4.27(GPA6) RN26.2
GPA7-4: IC4.28(GPA7) RN26.1
GPB0-4: IC4.1(GPB0) RN27.4
GPB1-4: IC4.2(GPB1) RN27.3
GPB2-4: IC4.3(GPB2) RN27.2
GPB3-4: IC4.4(GPB3) RN27.1
GPB4-4: IC4.5(GPB4) RN28.4
GPB5-4: IC4.6(GPB5) RN28.3
GPB6-4: IC4.7(GPB6) RN28.2
GPB7-4: IC4.8(GPB7) RN28.1
N$15: IC4.17(A2) J10.6 RN52.8
N$16: IC4.15(A0) J10.2 RN52.6
N$17: IC4.16(A1) J10.4 RN52.7
SCL: IC4.12(SCL) ; also sheet 1,3,4,5,7,8,9,10
SDA: IC4.13(SDA) ; also sheet 1,3,4,5,7,8,9,10
VCC: C4.1 IC4.9(VDD) J10.1 J10.3 J10.5 RN29.5 RN29.6 RN29.7 RN29.8 RN30.5 RN30.6 RN30.7 RN30.8 RN31.5 RN31.6 RN31.7 RN31.8 RN32.5 RN32.6 RN32.7 RN32.8 ; also sheet 1,3,4,5,7,8,9,10
Unconnected: IC4.19(INTB) RN52.5

## Sheet 7 of 10
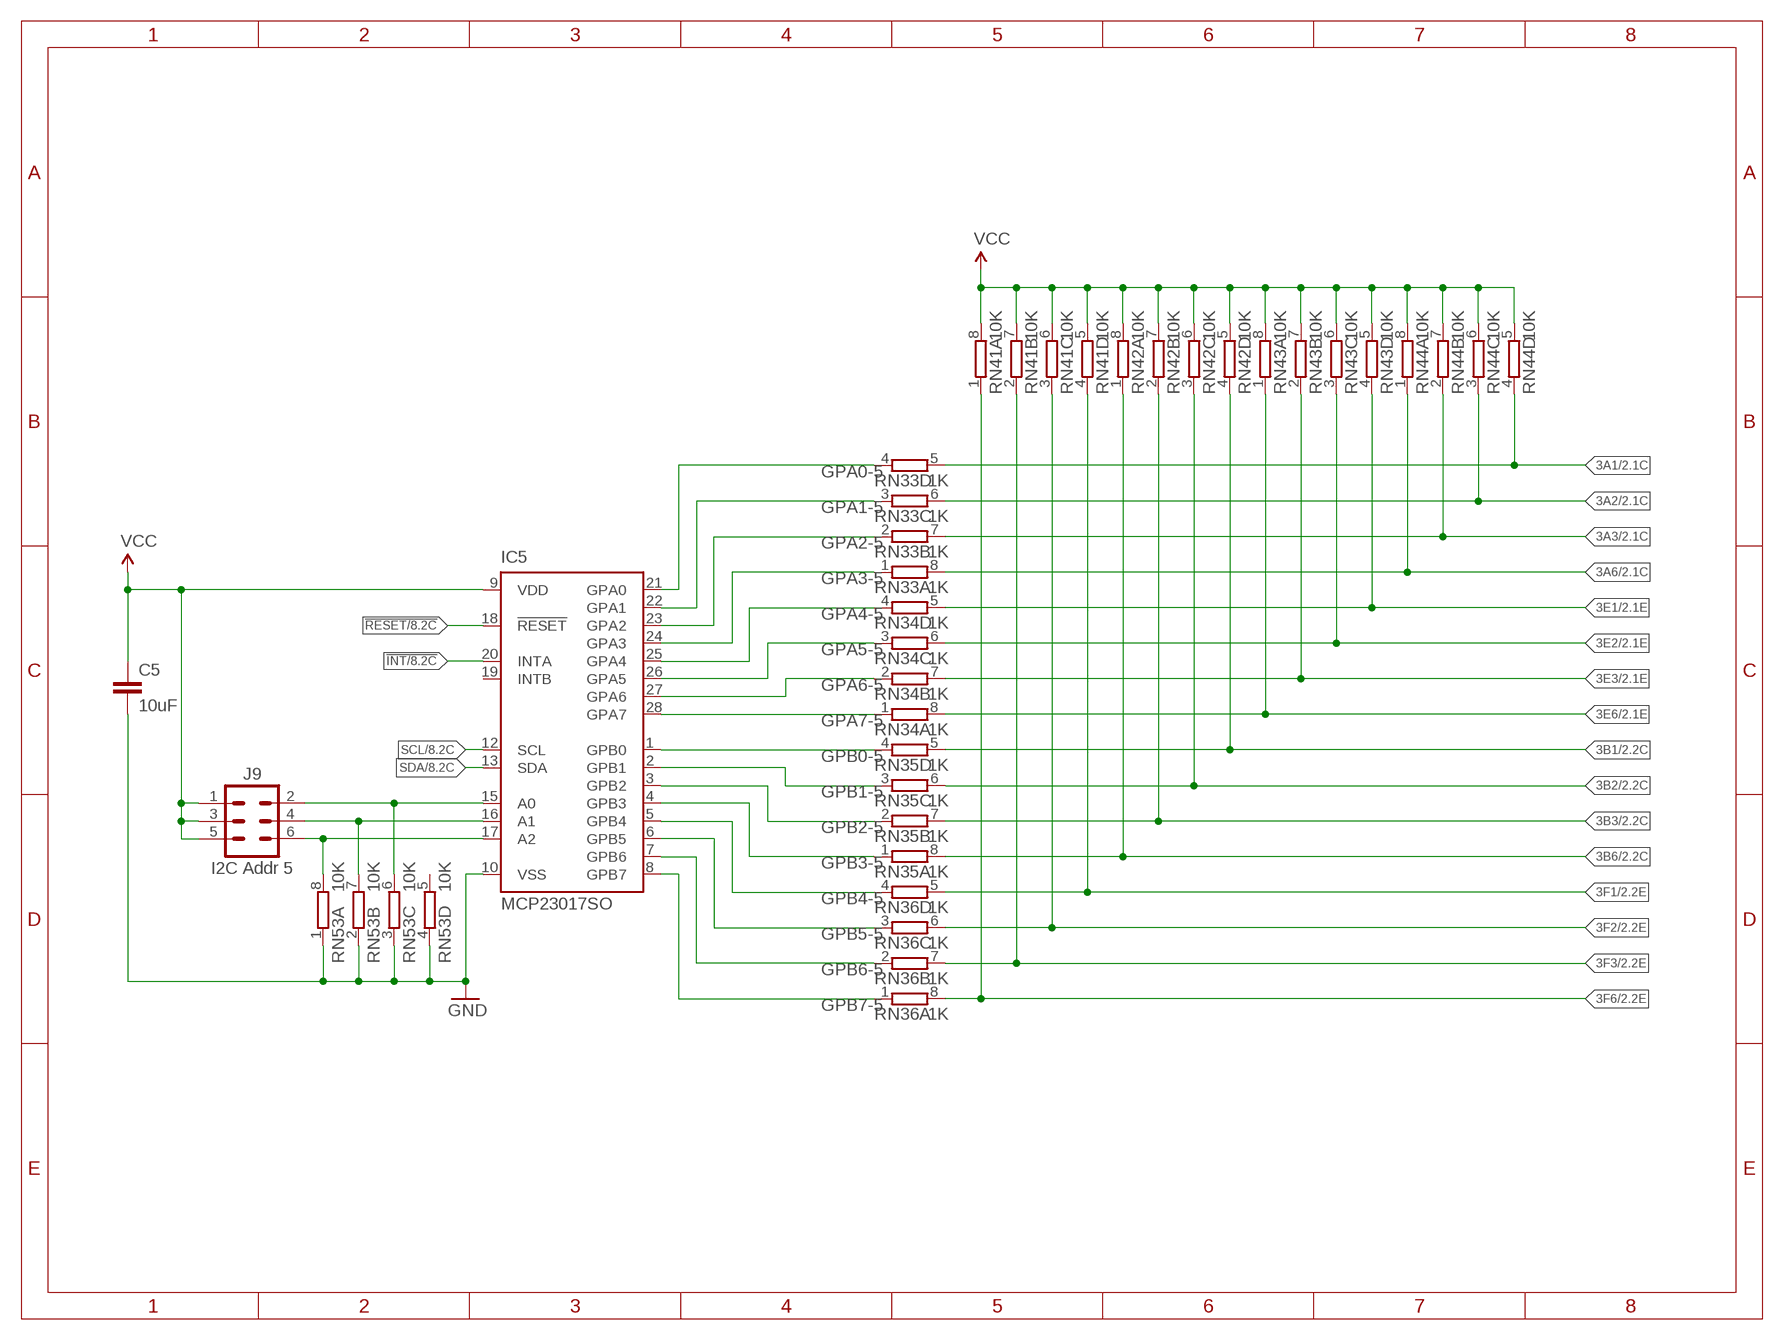
[diagram p6: schematic, sheet 7]

### Parts
C5  10uF  CAP0805  [C0805]
IC5  MCP23017SO  [SO28W]
J9  I2C Addr 5  M02X3-PIN  [2X03-P]
RN33  1K  4R-NCAY16  [CAY16]
RN34  1K  4R-NCAY16  [CAY16]
RN35  1K  4R-NCAY16  [CAY16]
RN36  1K  4R-NCAY16  [CAY16]
RN41  10K  4R-NCAY16  [CAY16]
RN42  10K  4R-NCAY16  [CAY16]
RN43  10K  4R-NCAY16  [CAY16]
RN44  10K  4R-NCAY16  [CAY16]
RN53  10K  4R-NCAY16  [CAY16]

### Nets
3A1: RN33.5 RN44.4 ; also sheet 2
3A2: RN33.6 RN44.3 ; also sheet 2
3A3: RN33.7 RN44.2 ; also sheet 2
3A6: RN33.8 RN44.1 ; also sheet 2
3B1: RN35.5 RN42.4 ; also sheet 2
3B2: RN35.6 RN42.3 ; also sheet 2
3B3: RN35.7 RN42.2 ; also sheet 2
3B6: RN35.8 RN42.1 ; also sheet 2
3E1: RN34.5 RN43.4 ; also sheet 2
3E2: RN34.6 RN43.3 ; also sheet 2
3E3: RN34.7 RN43.2 ; also sheet 2
3E6: RN34.8 RN43.1 ; also sheet 2
3F1: RN36.5 RN41.4 ; also sheet 2
3F2: RN36.6 RN41.3 ; also sheet 2
3F3: RN36.7 RN41.2 ; also sheet 2
3F6: RN36.8 RN41.1 ; also sheet 2
!INT: IC5.20(INTA) ; also sheet 1,3,4,5,6,8,9,10
!RESET: IC5.18(!RESET) ; also sheet 1,3,4,5,6,8,9,10
GND: C5.2 IC5.10(VSS) RN53.1 RN53.2 RN53.3 RN53.4 ; also sheet 1,2,3,4,5,6,8,9,10
GPA0-5: IC5.21(GPA0) RN33.4
GPA1-5: IC5.22(GPA1) RN33.3
GPA2-5: IC5.23(GPA2) RN33.2
GPA3-5: IC5.24(GPA3) RN33.1
GPA4-5: IC5.25(GPA4) RN34.4
GPA5-5: IC5.26(GPA5) RN34.3
GPA6-5: IC5.27(GPA6) RN34.2
GPA7-5: IC5.28(GPA7) RN34.1
GPB0-5: IC5.1(GPB0) RN35.4
GPB1-5: IC5.2(GPB1) RN35.3
GPB2-5: IC5.3(GPB2) RN35.2
GPB3-5: IC5.4(GPB3) RN35.1
GPB4-5: IC5.5(GPB4) RN36.4
GPB5-5: IC5.6(GPB5) RN36.3
GPB6-5: IC5.7(GPB6) RN36.2
GPB7-5: IC5.8(GPB7) RN36.1
N$18: IC5.17(A2) J9.6 RN53.8
N$19: IC5.15(A0) J9.2 RN53.6
N$20: IC5.16(A1) J9.4 RN53.7
SCL: IC5.12(SCL) ; also sheet 1,3,4,5,6,8,9,10
SDA: IC5.13(SDA) ; also sheet 1,3,4,5,6,8,9,10
VCC: C5.1 IC5.9(VDD) J9.1 J9.3 J9.5 RN41.5 RN41.6 RN41.7 RN41.8 RN42.5 RN42.6 RN42.7 RN42.8 RN43.5 RN43.6 RN43.7 RN43.8 RN44.5 RN44.6 RN44.7 RN44.8 ; also sheet 1,3,4,5,6,8,9,10
Unconnected: IC5.19(INTB) RN53.5

## Sheet 8 of 10
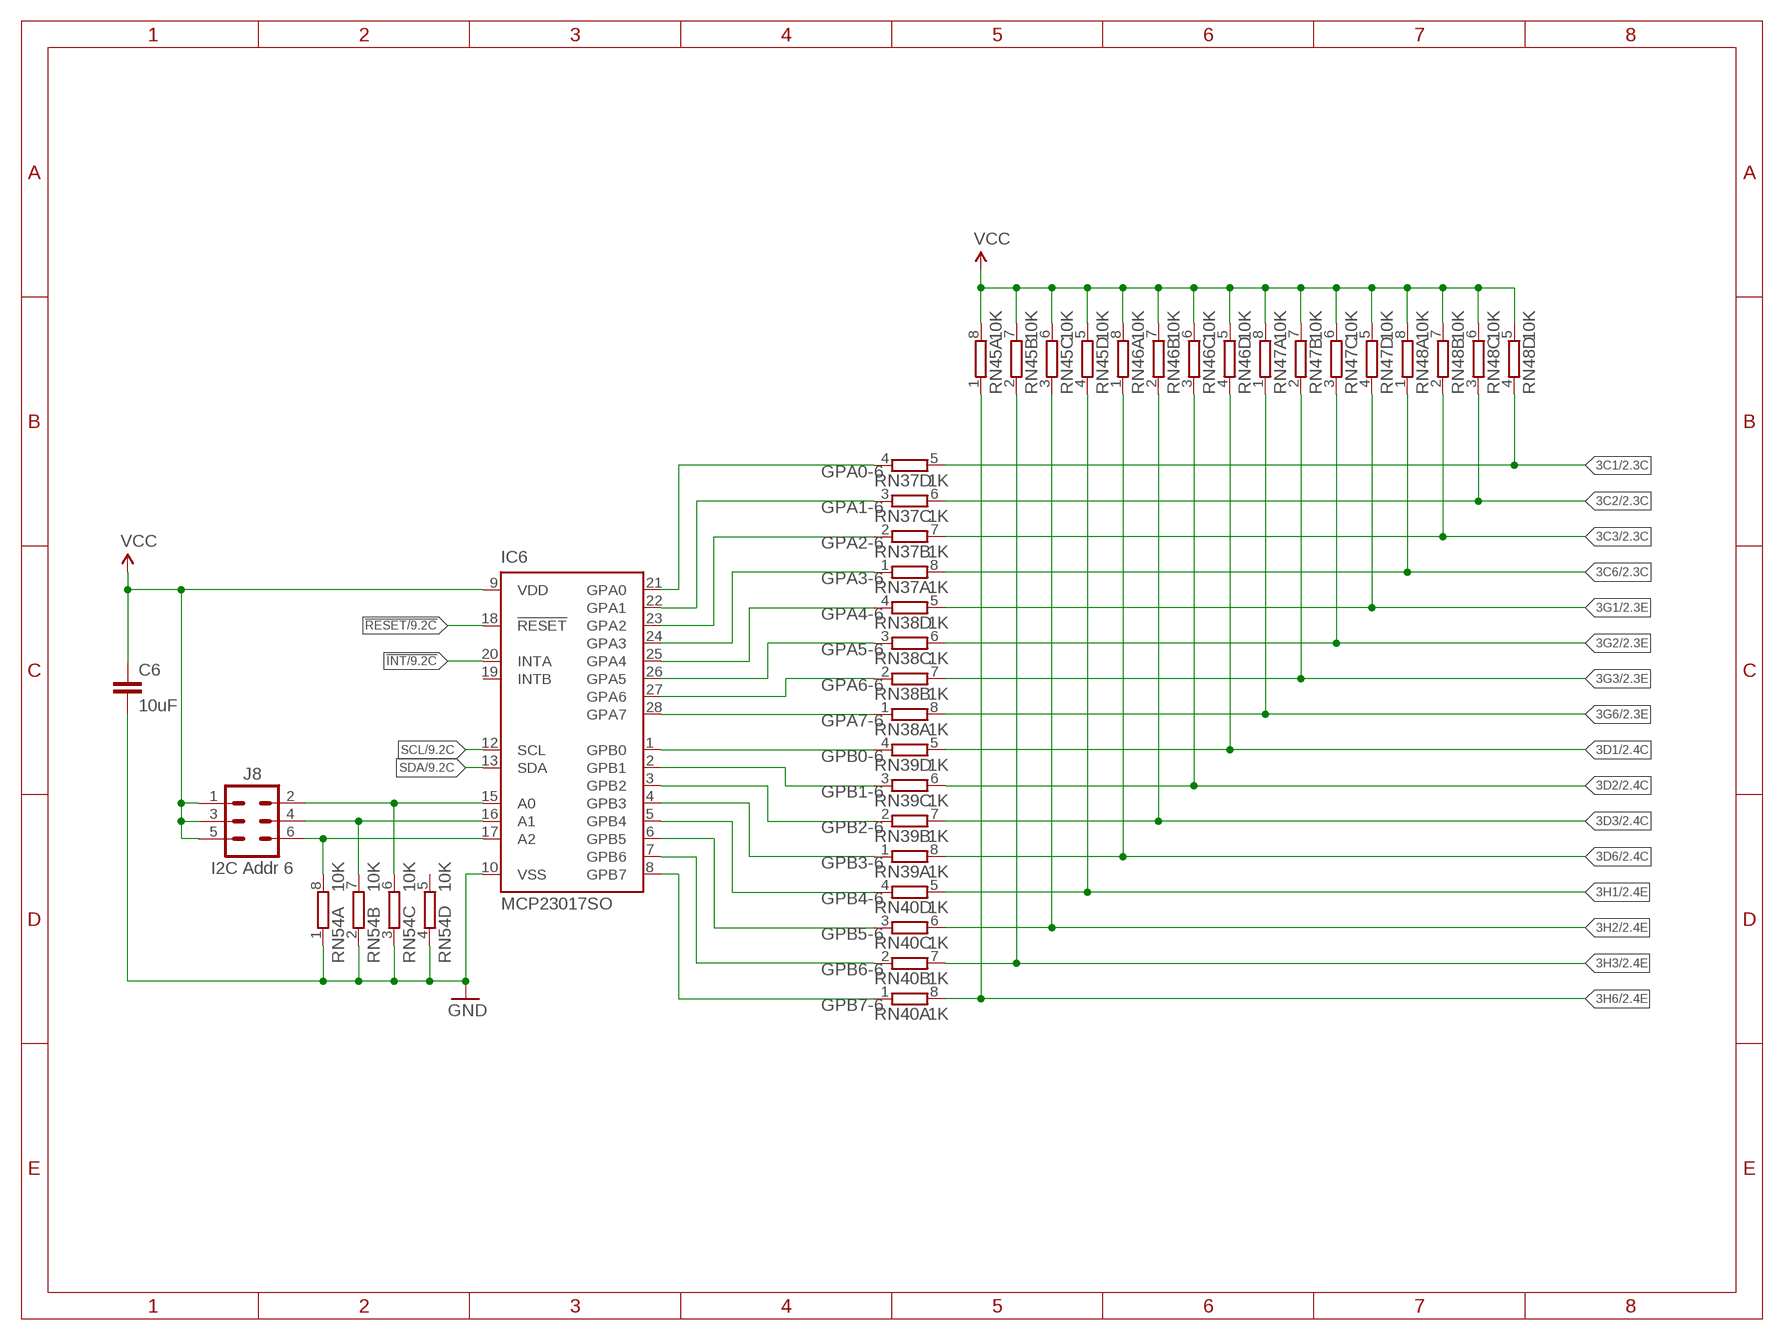
[diagram p7: schematic, sheet 8]

### Parts
C6  10uF  CAP0805  [C0805]
IC6  MCP23017SO  [SO28W]
J8  I2C Addr 6  M02X3-PIN  [2X03-P]
RN37  1K  4R-NCAY16  [CAY16]
RN38  1K  4R-NCAY16  [CAY16]
RN39  1K  4R-NCAY16  [CAY16]
RN40  1K  4R-NCAY16  [CAY16]
RN45  10K  4R-NCAY16  [CAY16]
RN46  10K  4R-NCAY16  [CAY16]
RN47  10K  4R-NCAY16  [CAY16]
RN48  10K  4R-NCAY16  [CAY16]
RN54  10K  4R-NCAY16  [CAY16]

### Nets
3C1: RN37.5 RN48.4 ; also sheet 2
3C2: RN37.6 RN48.3 ; also sheet 2
3C3: RN37.7 RN48.2 ; also sheet 2
3C6: RN37.8 RN48.1 ; also sheet 2
3D1: RN39.5 RN46.4 ; also sheet 2
3D2: RN39.6 RN46.3 ; also sheet 2
3D3: RN39.7 RN46.2 ; also sheet 2
3D6: RN39.8 RN46.1 ; also sheet 2
3G1: RN38.5 RN47.4 ; also sheet 2
3G2: RN38.6 RN47.3 ; also sheet 2
3G3: RN38.7 RN47.2 ; also sheet 2
3G6: RN38.8 RN47.1 ; also sheet 2
3H1: RN40.5 RN45.4 ; also sheet 2
3H2: RN40.6 RN45.3 ; also sheet 2
3H3: RN40.7 RN45.2 ; also sheet 2
3H6: RN40.8 RN45.1 ; also sheet 2
!INT: IC6.20(INTA) ; also sheet 1,3,4,5,6,7,9,10
!RESET: IC6.18(!RESET) ; also sheet 1,3,4,5,6,7,9,10
GND: C6.2 IC6.10(VSS) RN54.1 RN54.2 RN54.3 RN54.4 ; also sheet 1,2,3,4,5,6,7,9,10
GPA0-6: IC6.21(GPA0) RN37.4
GPA1-6: IC6.22(GPA1) RN37.3
GPA2-6: IC6.23(GPA2) RN37.2
GPA3-6: IC6.24(GPA3) RN37.1
GPA4-6: IC6.25(GPA4) RN38.4
GPA5-6: IC6.26(GPA5) RN38.3
GPA6-6: IC6.27(GPA6) RN38.2
GPA7-6: IC6.28(GPA7) RN38.1
GPB0-6: IC6.1(GPB0) RN39.4
GPB1-6: IC6.2(GPB1) RN39.3
GPB2-6: IC6.3(GPB2) RN39.2
GPB3-6: IC6.4(GPB3) RN39.1
GPB4-6: IC6.5(GPB4) RN40.4
GPB5-6: IC6.6(GPB5) RN40.3
GPB6-6: IC6.7(GPB6) RN40.2
GPB7-6: IC6.8(GPB7) RN40.1
N$21: IC6.17(A2) J8.6 RN54.8
N$22: IC6.15(A0) J8.2 RN54.6
N$23: IC6.16(A1) J8.4 RN54.7
SCL: IC6.12(SCL) ; also sheet 1,3,4,5,6,7,9,10
SDA: IC6.13(SDA) ; also sheet 1,3,4,5,6,7,9,10
VCC: C6.1 IC6.9(VDD) J8.1 J8.3 J8.5 RN45.5 RN45.6 RN45.7 RN45.8 RN46.5 RN46.6 RN46.7 RN46.8 RN47.5 RN47.6 RN47.7 RN47.8 RN48.5 RN48.6 RN48.7 RN48.8 ; also sheet 1,3,4,5,6,7,9,10
Unconnected: IC6.19(INTB) RN54.5

## Sheet 9 of 10
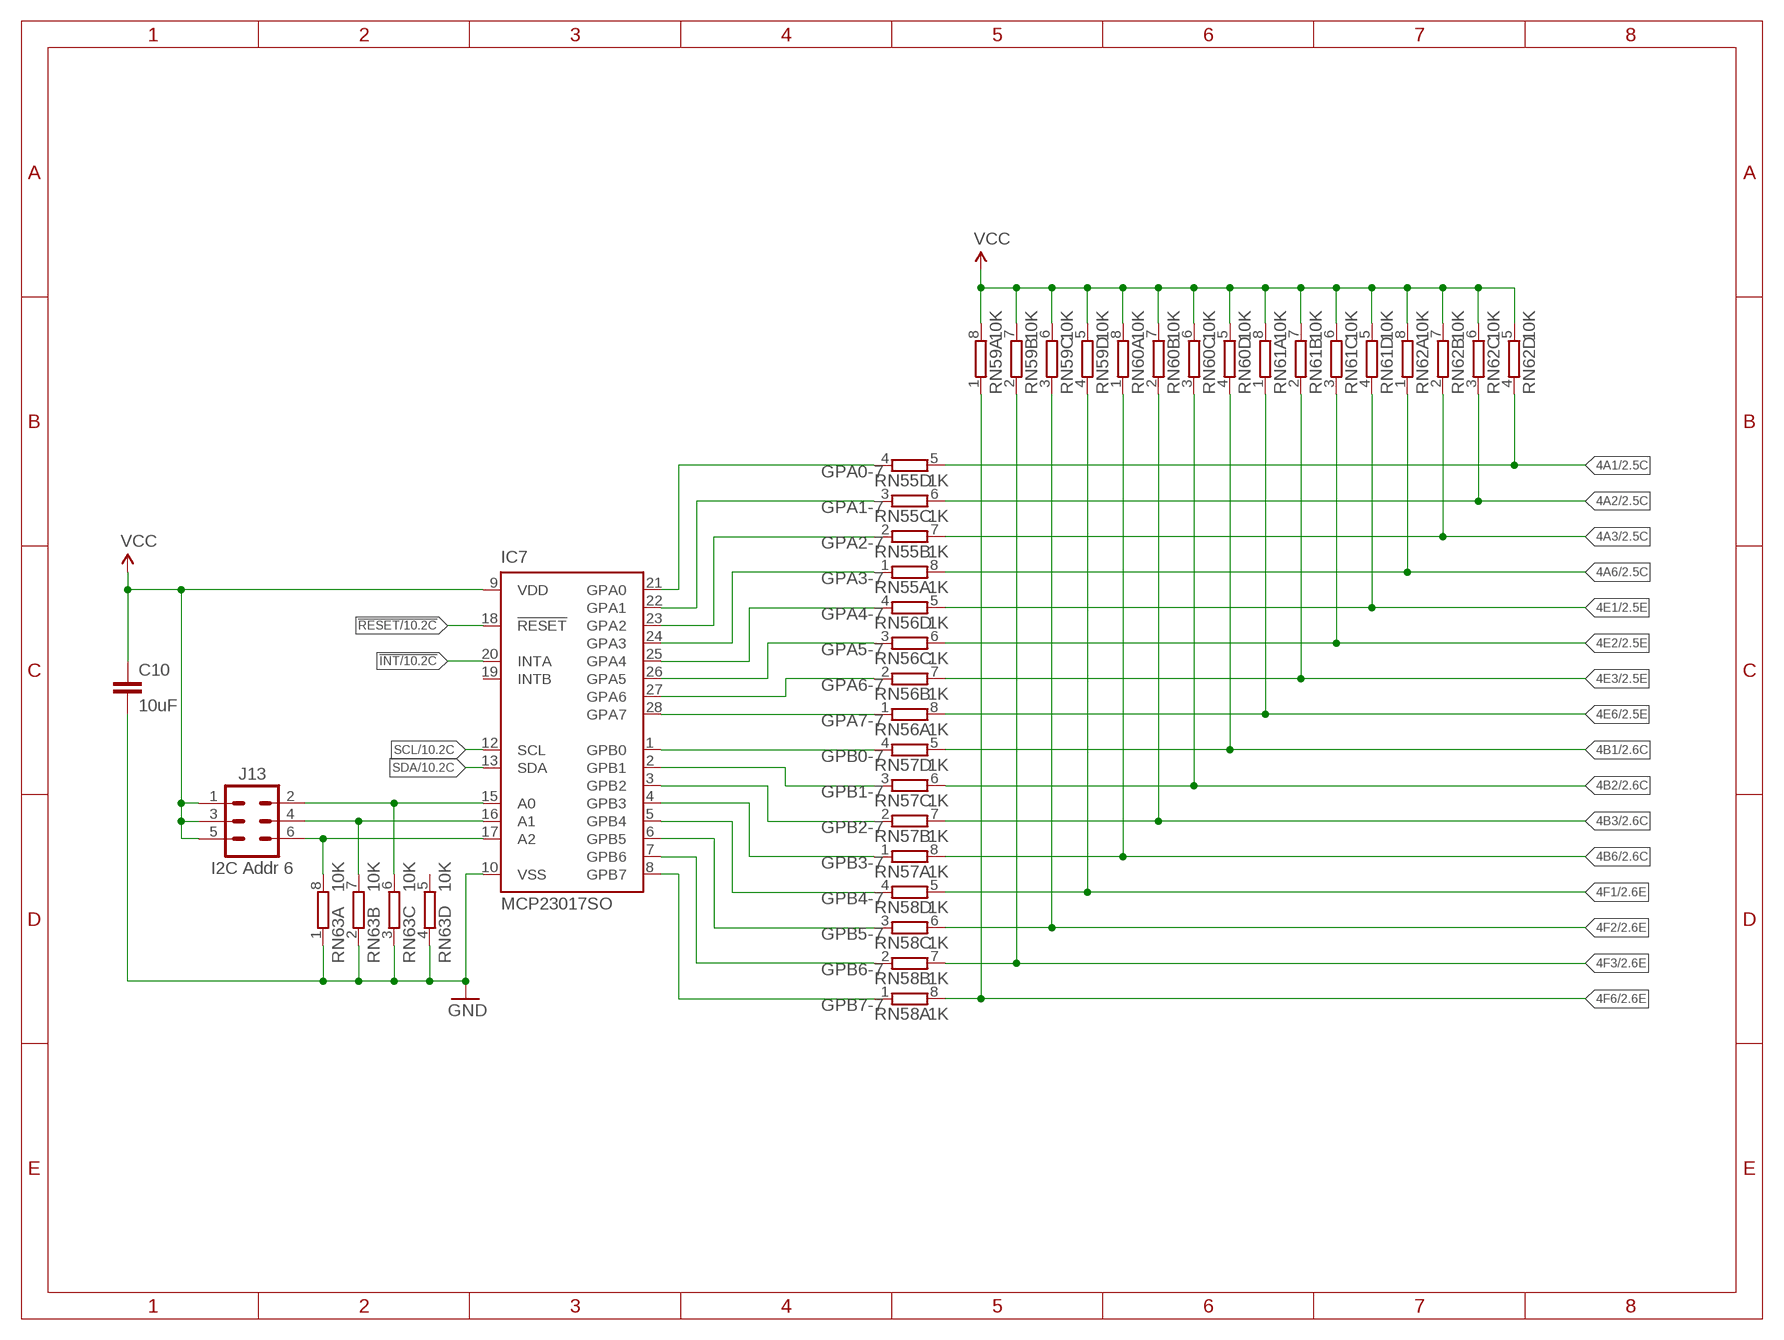
[diagram p8: schematic, sheet 9]

### Parts
C10  10uF  CAP0805  [C0805]
IC7  MCP23017SO  [SO28W]
J13  I2C Addr 6  M02X3-PIN  [2X03-P]
RN55  1K  4R-NCAY16  [CAY16]
RN56  1K  4R-NCAY16  [CAY16]
RN57  1K  4R-NCAY16  [CAY16]
RN58  1K  4R-NCAY16  [CAY16]
RN59  10K  4R-NCAY16  [CAY16]
RN60  10K  4R-NCAY16  [CAY16]
RN61  10K  4R-NCAY16  [CAY16]
RN62  10K  4R-NCAY16  [CAY16]
RN63  10K  4R-NCAY16  [CAY16]

### Nets
4A1: RN55.5 RN62.4 ; also sheet 2
4A2: RN55.6 RN62.3 ; also sheet 2
4A3: RN55.7 RN62.2 ; also sheet 2
4A6: RN55.8 RN62.1 ; also sheet 2
4B1: RN57.5 RN60.4 ; also sheet 2
4B2: RN57.6 RN60.3 ; also sheet 2
4B3: RN57.7 RN60.2 ; also sheet 2
4B6: RN57.8 RN60.1 ; also sheet 2
4E1: RN56.5 RN61.4 ; also sheet 2
4E2: RN56.6 RN61.3 ; also sheet 2
4E3: RN56.7 RN61.2 ; also sheet 2
4E6: RN56.8 RN61.1 ; also sheet 2
4F1: RN58.5 RN59.4 ; also sheet 2
4F2: RN58.6 RN59.3 ; also sheet 2
4F3: RN58.7 RN59.2 ; also sheet 2
4F6: RN58.8 RN59.1 ; also sheet 2
!INT: IC7.20(INTA) ; also sheet 1,3,4,5,6,7,8,10
!RESET: IC7.18(!RESET) ; also sheet 1,3,4,5,6,7,8,10
GND: C10.2 IC7.10(VSS) RN63.1 RN63.2 RN63.3 RN63.4 ; also sheet 1,2,3,4,5,6,7,8,10
GPA0-7: IC7.21(GPA0) RN55.4
GPA1-7: IC7.22(GPA1) RN55.3
GPA2-7: IC7.23(GPA2) RN55.2
GPA3-7: IC7.24(GPA3) RN55.1
GPA4-7: IC7.25(GPA4) RN56.4
GPA5-7: IC7.26(GPA5) RN56.3
GPA6-7: IC7.27(GPA6) RN56.2
GPA7-7: IC7.28(GPA7) RN56.1
GPB0-7: IC7.1(GPB0) RN57.4
GPB1-7: IC7.2(GPB1) RN57.3
GPB2-7: IC7.3(GPB2) RN57.2
GPB3-7: IC7.4(GPB3) RN57.1
GPB4-7: IC7.5(GPB4) RN58.4
GPB5-7: IC7.6(GPB5) RN58.3
GPB6-7: IC7.7(GPB6) RN58.2
GPB7-7: IC7.8(GPB7) RN58.1
N$24: IC7.17(A2) J13.6 RN63.8
N$25: IC7.15(A0) J13.2 RN63.6
N$26: IC7.16(A1) J13.4 RN63.7
SCL: IC7.12(SCL) ; also sheet 1,3,4,5,6,7,8,10
SDA: IC7.13(SDA) ; also sheet 1,3,4,5,6,7,8,10
VCC: C10.1 IC7.9(VDD) J13.1 J13.3 J13.5 RN59.5 RN59.6 RN59.7 RN59.8 RN60.5 RN60.6 RN60.7 RN60.8 RN61.5 RN61.6 RN61.7 RN61.8 RN62.5 RN62.6 RN62.7 RN62.8 ; also sheet 1,3,4,5,6,7,8,10
Unconnected: IC7.19(INTB) RN63.5

## Sheet 10 of 10
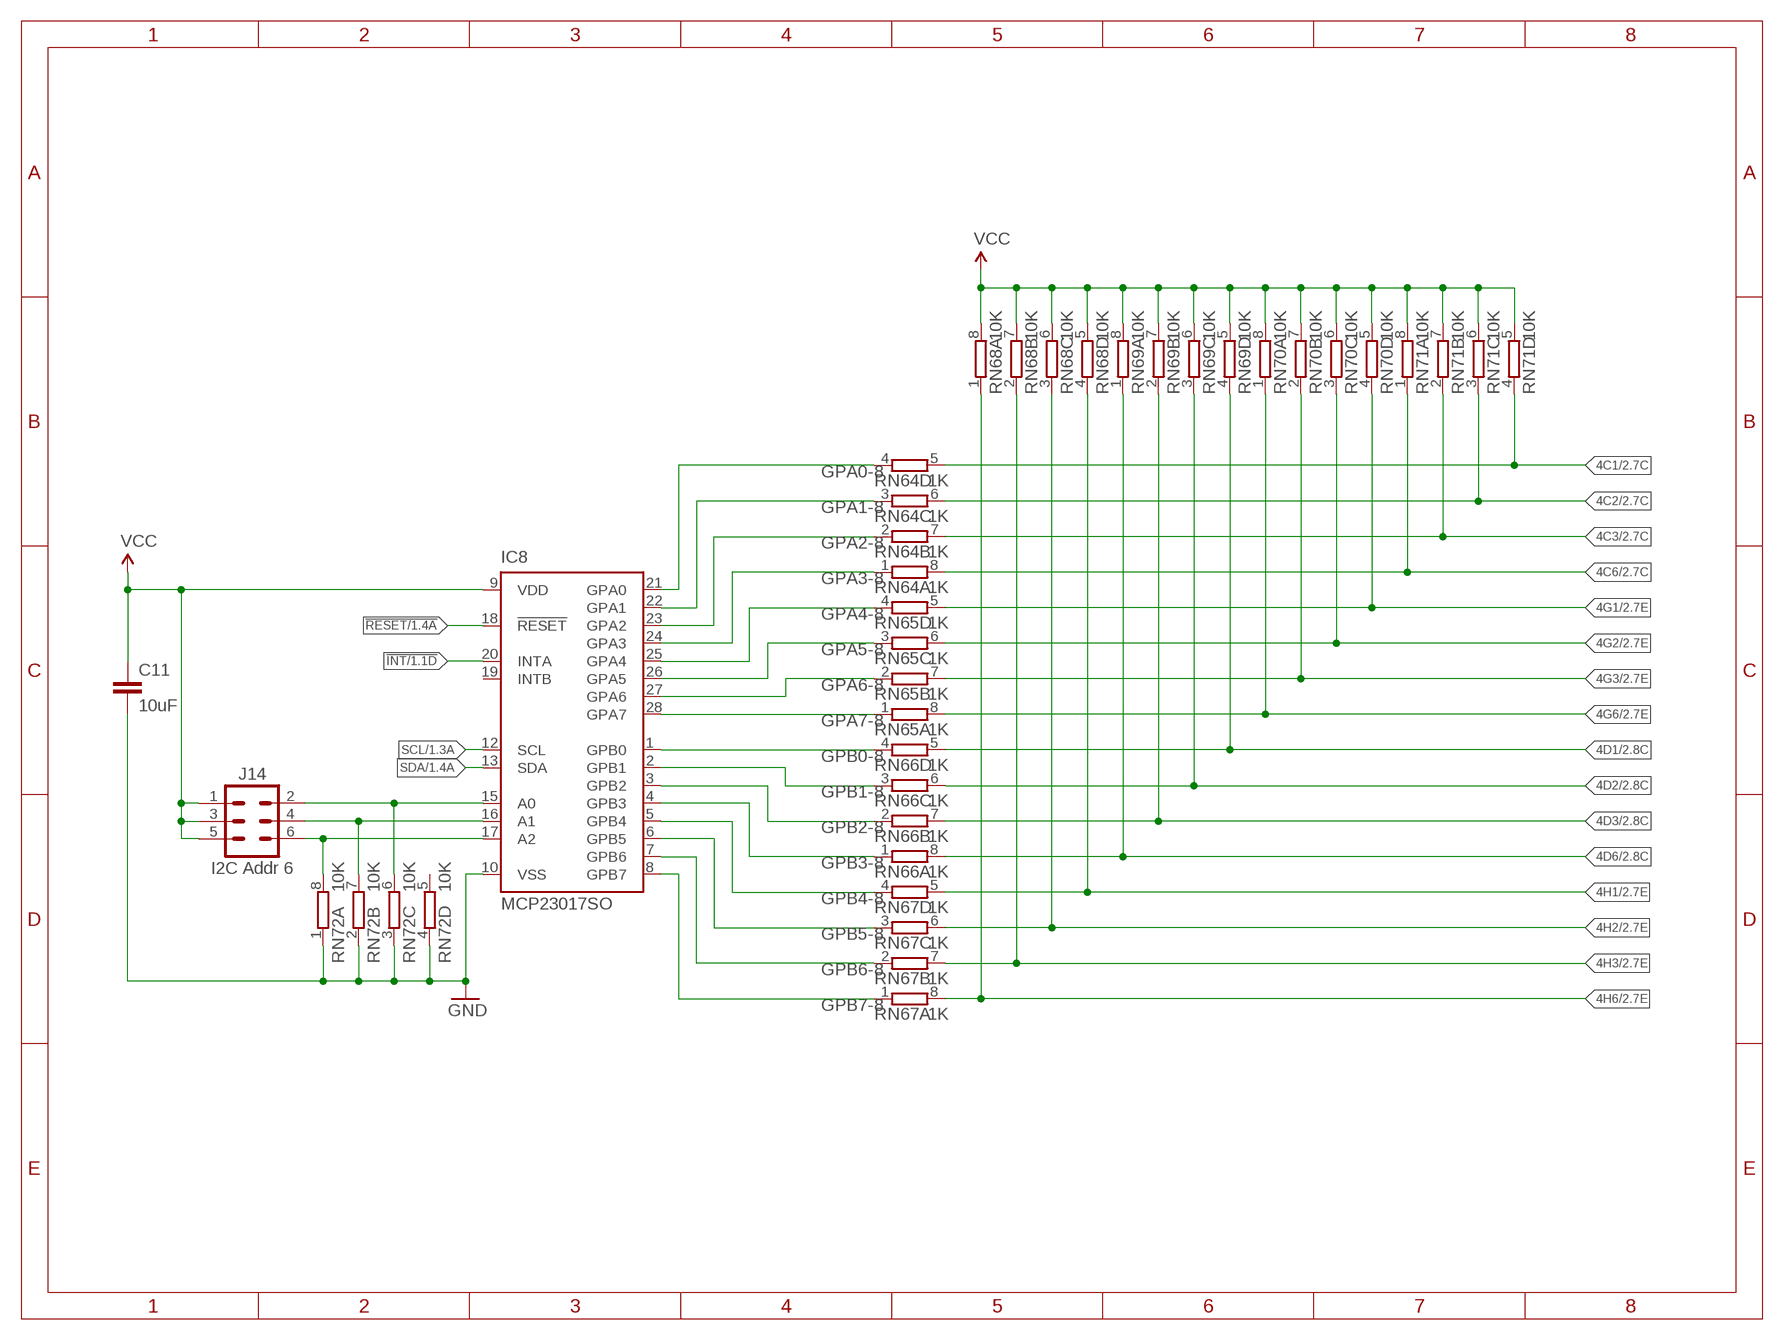
[diagram p9: schematic, sheet 10]

### Parts
C11  10uF  CAP0805  [C0805]
IC8  MCP23017SO  [SO28W]
J14  I2C Addr 6  M02X3-PIN  [2X03-P]
RN64  1K  4R-NCAY16  [CAY16]
RN65  1K  4R-NCAY16  [CAY16]
RN66  1K  4R-NCAY16  [CAY16]
RN67  1K  4R-NCAY16  [CAY16]
RN68  10K  4R-NCAY16  [CAY16]
RN69  10K  4R-NCAY16  [CAY16]
RN70  10K  4R-NCAY16  [CAY16]
RN71  10K  4R-NCAY16  [CAY16]
RN72  10K  4R-NCAY16  [CAY16]

### Nets
4C1: RN64.5 RN71.4 ; also sheet 2
4C2: RN64.6 RN71.3 ; also sheet 2
4C3: RN64.7 RN71.2 ; also sheet 2
4C6: RN64.8 RN71.1 ; also sheet 2
4D1: RN66.5 RN69.4 ; also sheet 2
4D2: RN66.6 RN69.3 ; also sheet 2
4D3: RN66.7 RN69.2 ; also sheet 2
4D6: RN66.8 RN69.1 ; also sheet 2
4G1: RN65.5 RN70.4 ; also sheet 2
4G2: RN65.6 RN70.3 ; also sheet 2
4G3: RN65.7 RN70.2 ; also sheet 2
4G6: RN65.8 RN70.1 ; also sheet 2
4H1: RN67.5 RN68.4 ; also sheet 2
4H2: RN67.6 RN68.3 ; also sheet 2
4H3: RN67.7 RN68.2 ; also sheet 2
4H6: RN67.8 RN68.1 ; also sheet 2
!INT: IC8.20(INTA) ; also sheet 1,3,4,5,6,7,8,9
!RESET: IC8.18(!RESET) ; also sheet 1,3,4,5,6,7,8,9
GND: C11.2 IC8.10(VSS) RN72.1 RN72.2 RN72.3 RN72.4 ; also sheet 1,2,3,4,5,6,7,8,9
GPA0-8: IC8.21(GPA0) RN64.4
GPA1-8: IC8.22(GPA1) RN64.3
GPA2-8: IC8.23(GPA2) RN64.2
GPA3-8: IC8.24(GPA3) RN64.1
GPA4-8: IC8.25(GPA4) RN65.4
GPA5-8: IC8.26(GPA5) RN65.3
GPA6-8: IC8.27(GPA6) RN65.2
GPA7-8: IC8.28(GPA7) RN65.1
GPB0-8: IC8.1(GPB0) RN66.4
GPB1-8: IC8.2(GPB1) RN66.3
GPB2-8: IC8.3(GPB2) RN66.2
GPB3-8: IC8.4(GPB3) RN66.1
GPB4-8: IC8.5(GPB4) RN67.4
GPB5-8: IC8.6(GPB5) RN67.3
GPB6-8: IC8.7(GPB6) RN67.2
GPB7-8: IC8.8(GPB7) RN67.1
N$27: IC8.17(A2) J14.6 RN72.8
N$28: IC8.15(A0) J14.2 RN72.6
N$29: IC8.16(A1) J14.4 RN72.7
SCL: IC8.12(SCL) ; also sheet 1,3,4,5,6,7,8,9
SDA: IC8.13(SDA) ; also sheet 1,3,4,5,6,7,8,9
VCC: C11.1 IC8.9(VDD) J14.1 J14.3 J14.5 RN68.5 RN68.6 RN68.7 RN68.8 RN69.5 RN69.6 RN69.7 RN69.8 RN70.5 RN70.6 RN70.7 RN70.8 RN71.5 RN71.6 RN71.7 RN71.8 ; also sheet 1,3,4,5,6,7,8,9
Unconnected: IC8.19(INTB) RN72.5

## Library data of the parts
C1-C6 C10 C11 = SuperHouse-Capacitors:CAP: Capacitor Standard ceramic capacitor
C7-C9 C12 = SuperHouse-Capacitors:CAP_POL: Capacitor Polarized These are standard SMD and PTH capacitors. Normally 10uF, 47uF, and 100uF in electrolytic and tantalum varieties. Always verify the external diameter of the through hole cap, it varies with capacity, voltage, and manufacturer. The EIA devices should be standard.
FID1-FID3 = SuperHouse-Symbols:FIDUCIAL: Fiducial Alignment Points Various fiducial points for machine vision alignment.
IC1-IC8 = SuperHouse-ICs:MCP23017: http://ww1.microchip.com/downloads/en/DeviceDoc/21952a.pdf Source: http://ww1.microchip.com/downloads/en/DeviceDoc/21952a.pdf
J1 J2 J7-J14 = SuperHouse-Connectors:M02X3: M6 header in 2x3 format
J3 = SuperHouse-Connectors:M01: 1-way header Standard 1x1 header
J4-J6 J15 = SuperHouse-Connectors:RJ45-X8: 8-way RJ45 socket, PCB mount. 2 rows of 4.
LED1 LED2 = SuperHouse-LEDs:LED: LEDs in various sizes including 5mm and 3mm PTH, and 0402, 0603, 0805, etc SMT
R97-R101 = SuperHouse-Resistors:RESISTOR: Resistors in both surface-mount and through-hole versions.
RN1-RN72 = SuperHouse-Resistors:4R-N: Array Chip Resistor Source: RS Component / Phycomp
SJ1 SJ2 = SuperHouse-Connectors:M02: 2-way header Standard 1x2 header, and screw terminal variations
SJ3 = SuperHouse-Jumpers:SJ: SMD solder jumper, normally-open. Add solder to close the connection.